# EAGLE design RadioBerry (EAGLE 7.7.0)
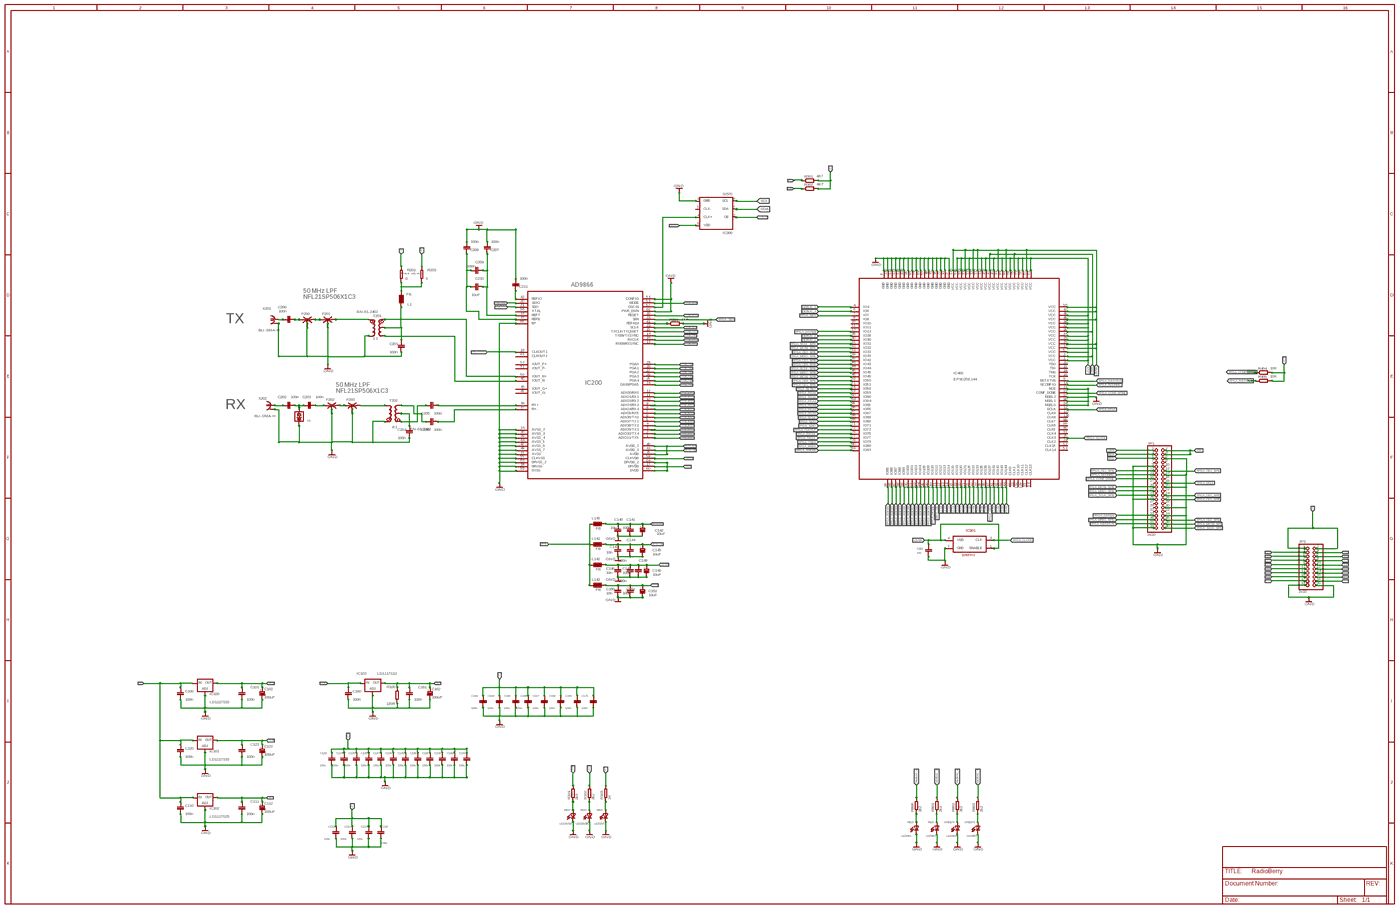
[diagram p0: schematic, sheet 1, overview]
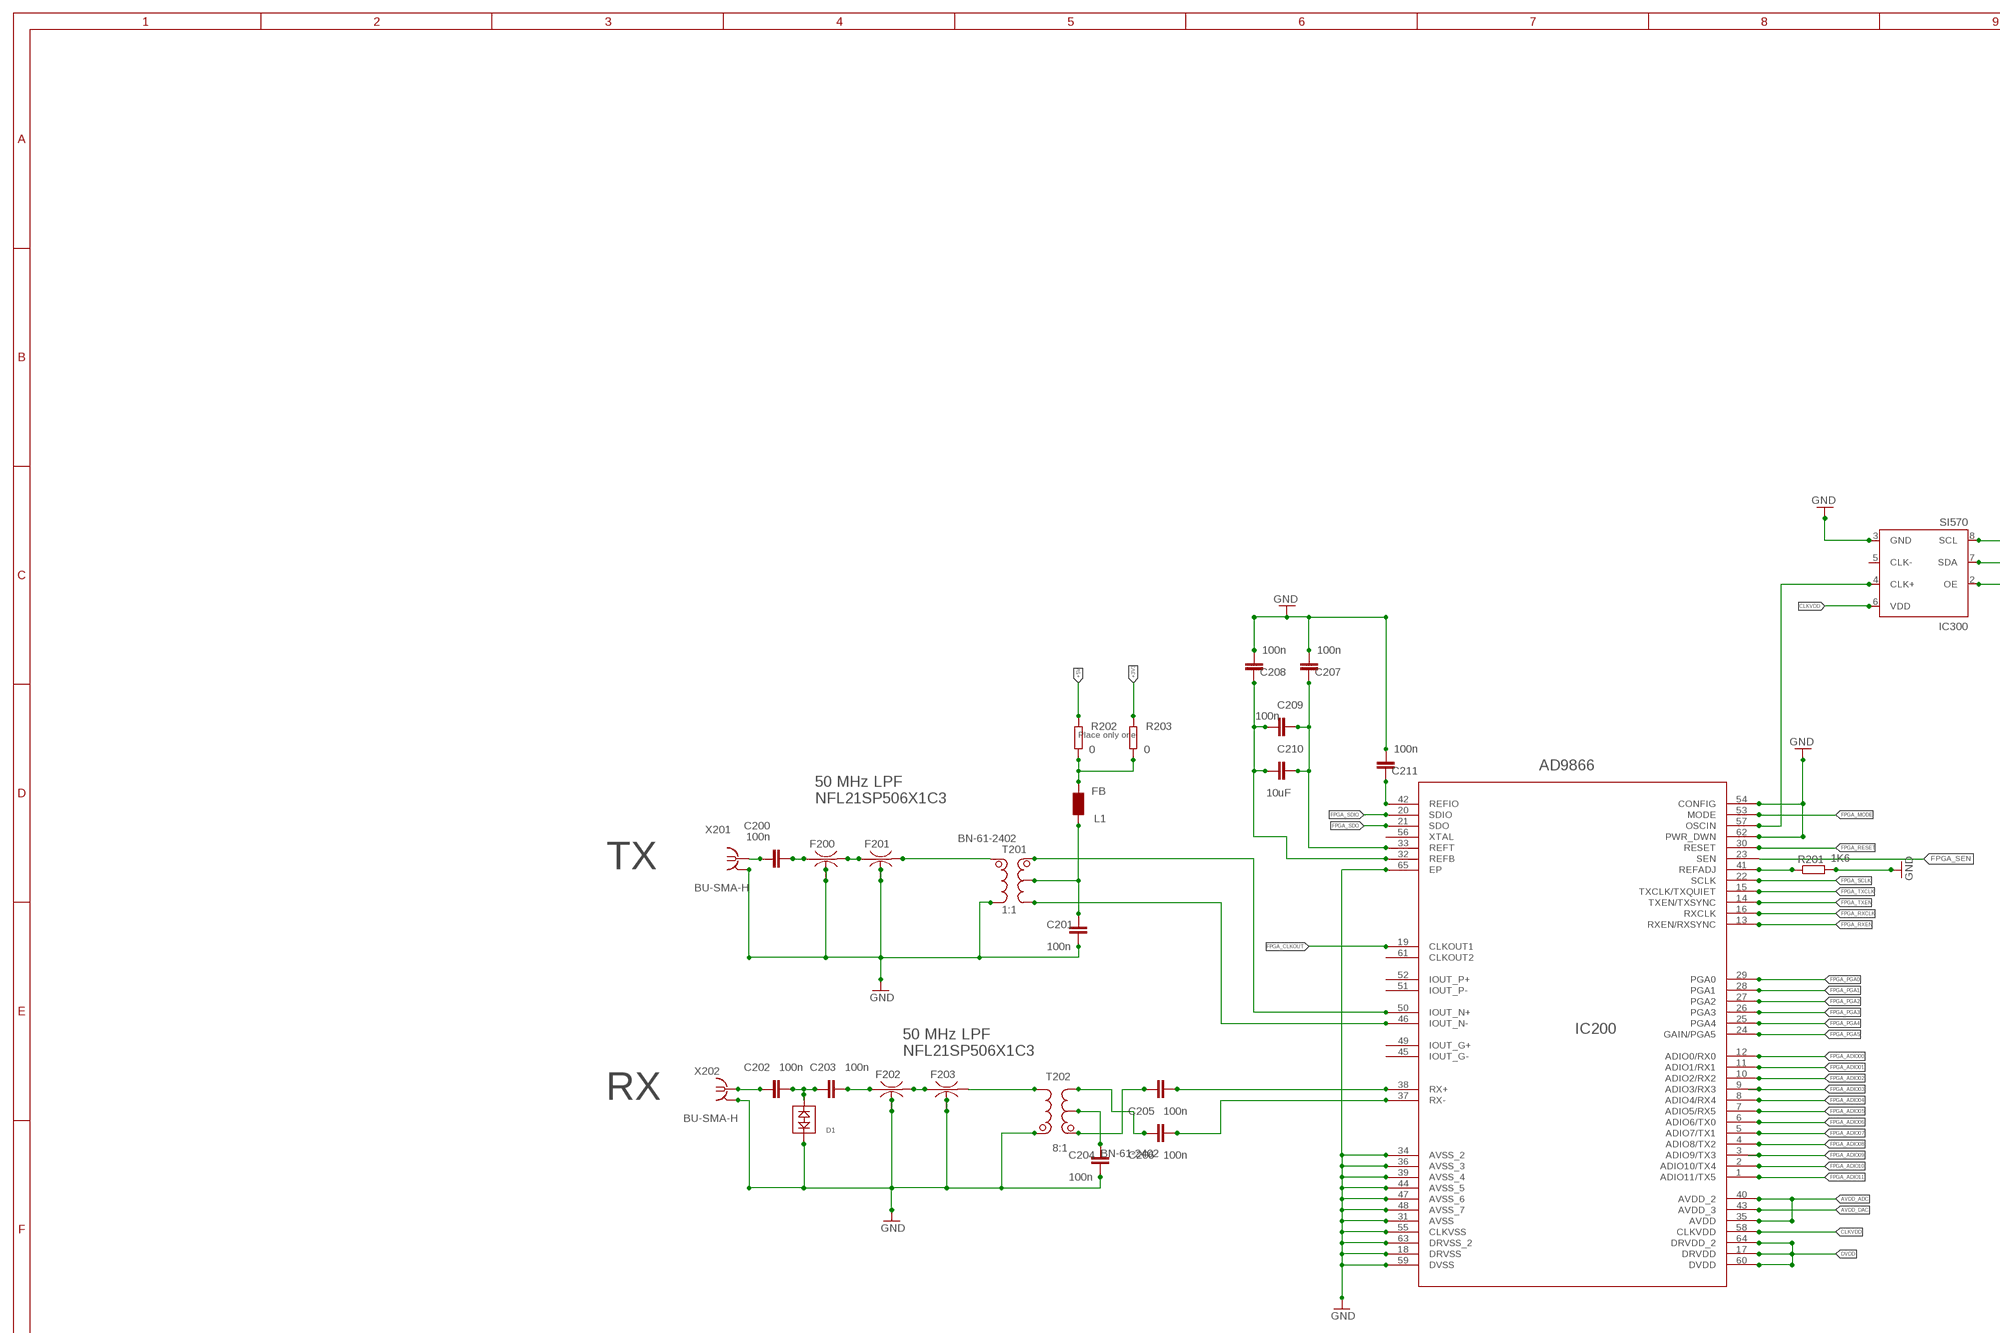
[diagram p1: schematic, sheet 1, part 1 of 4]
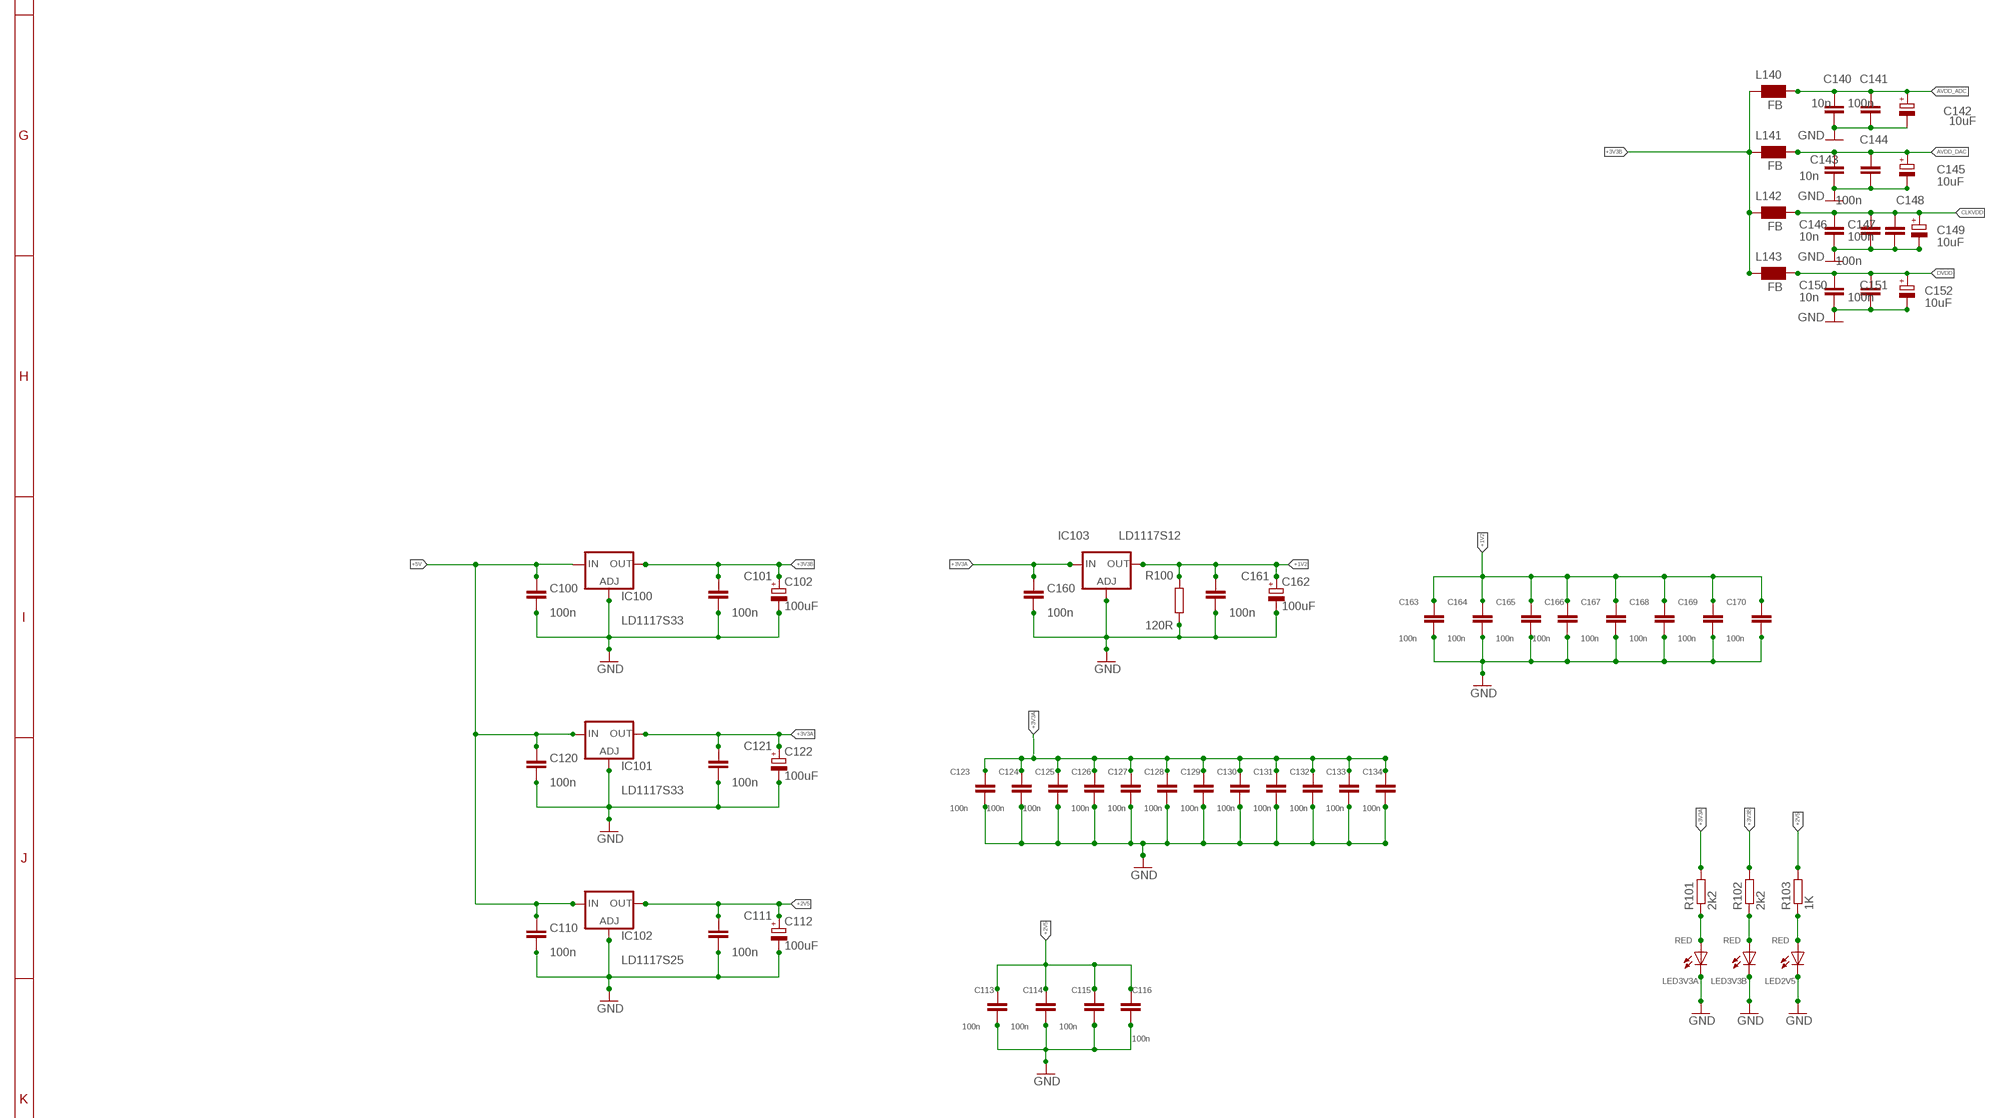
[diagram p2: schematic, sheet 1, part 2 of 4]
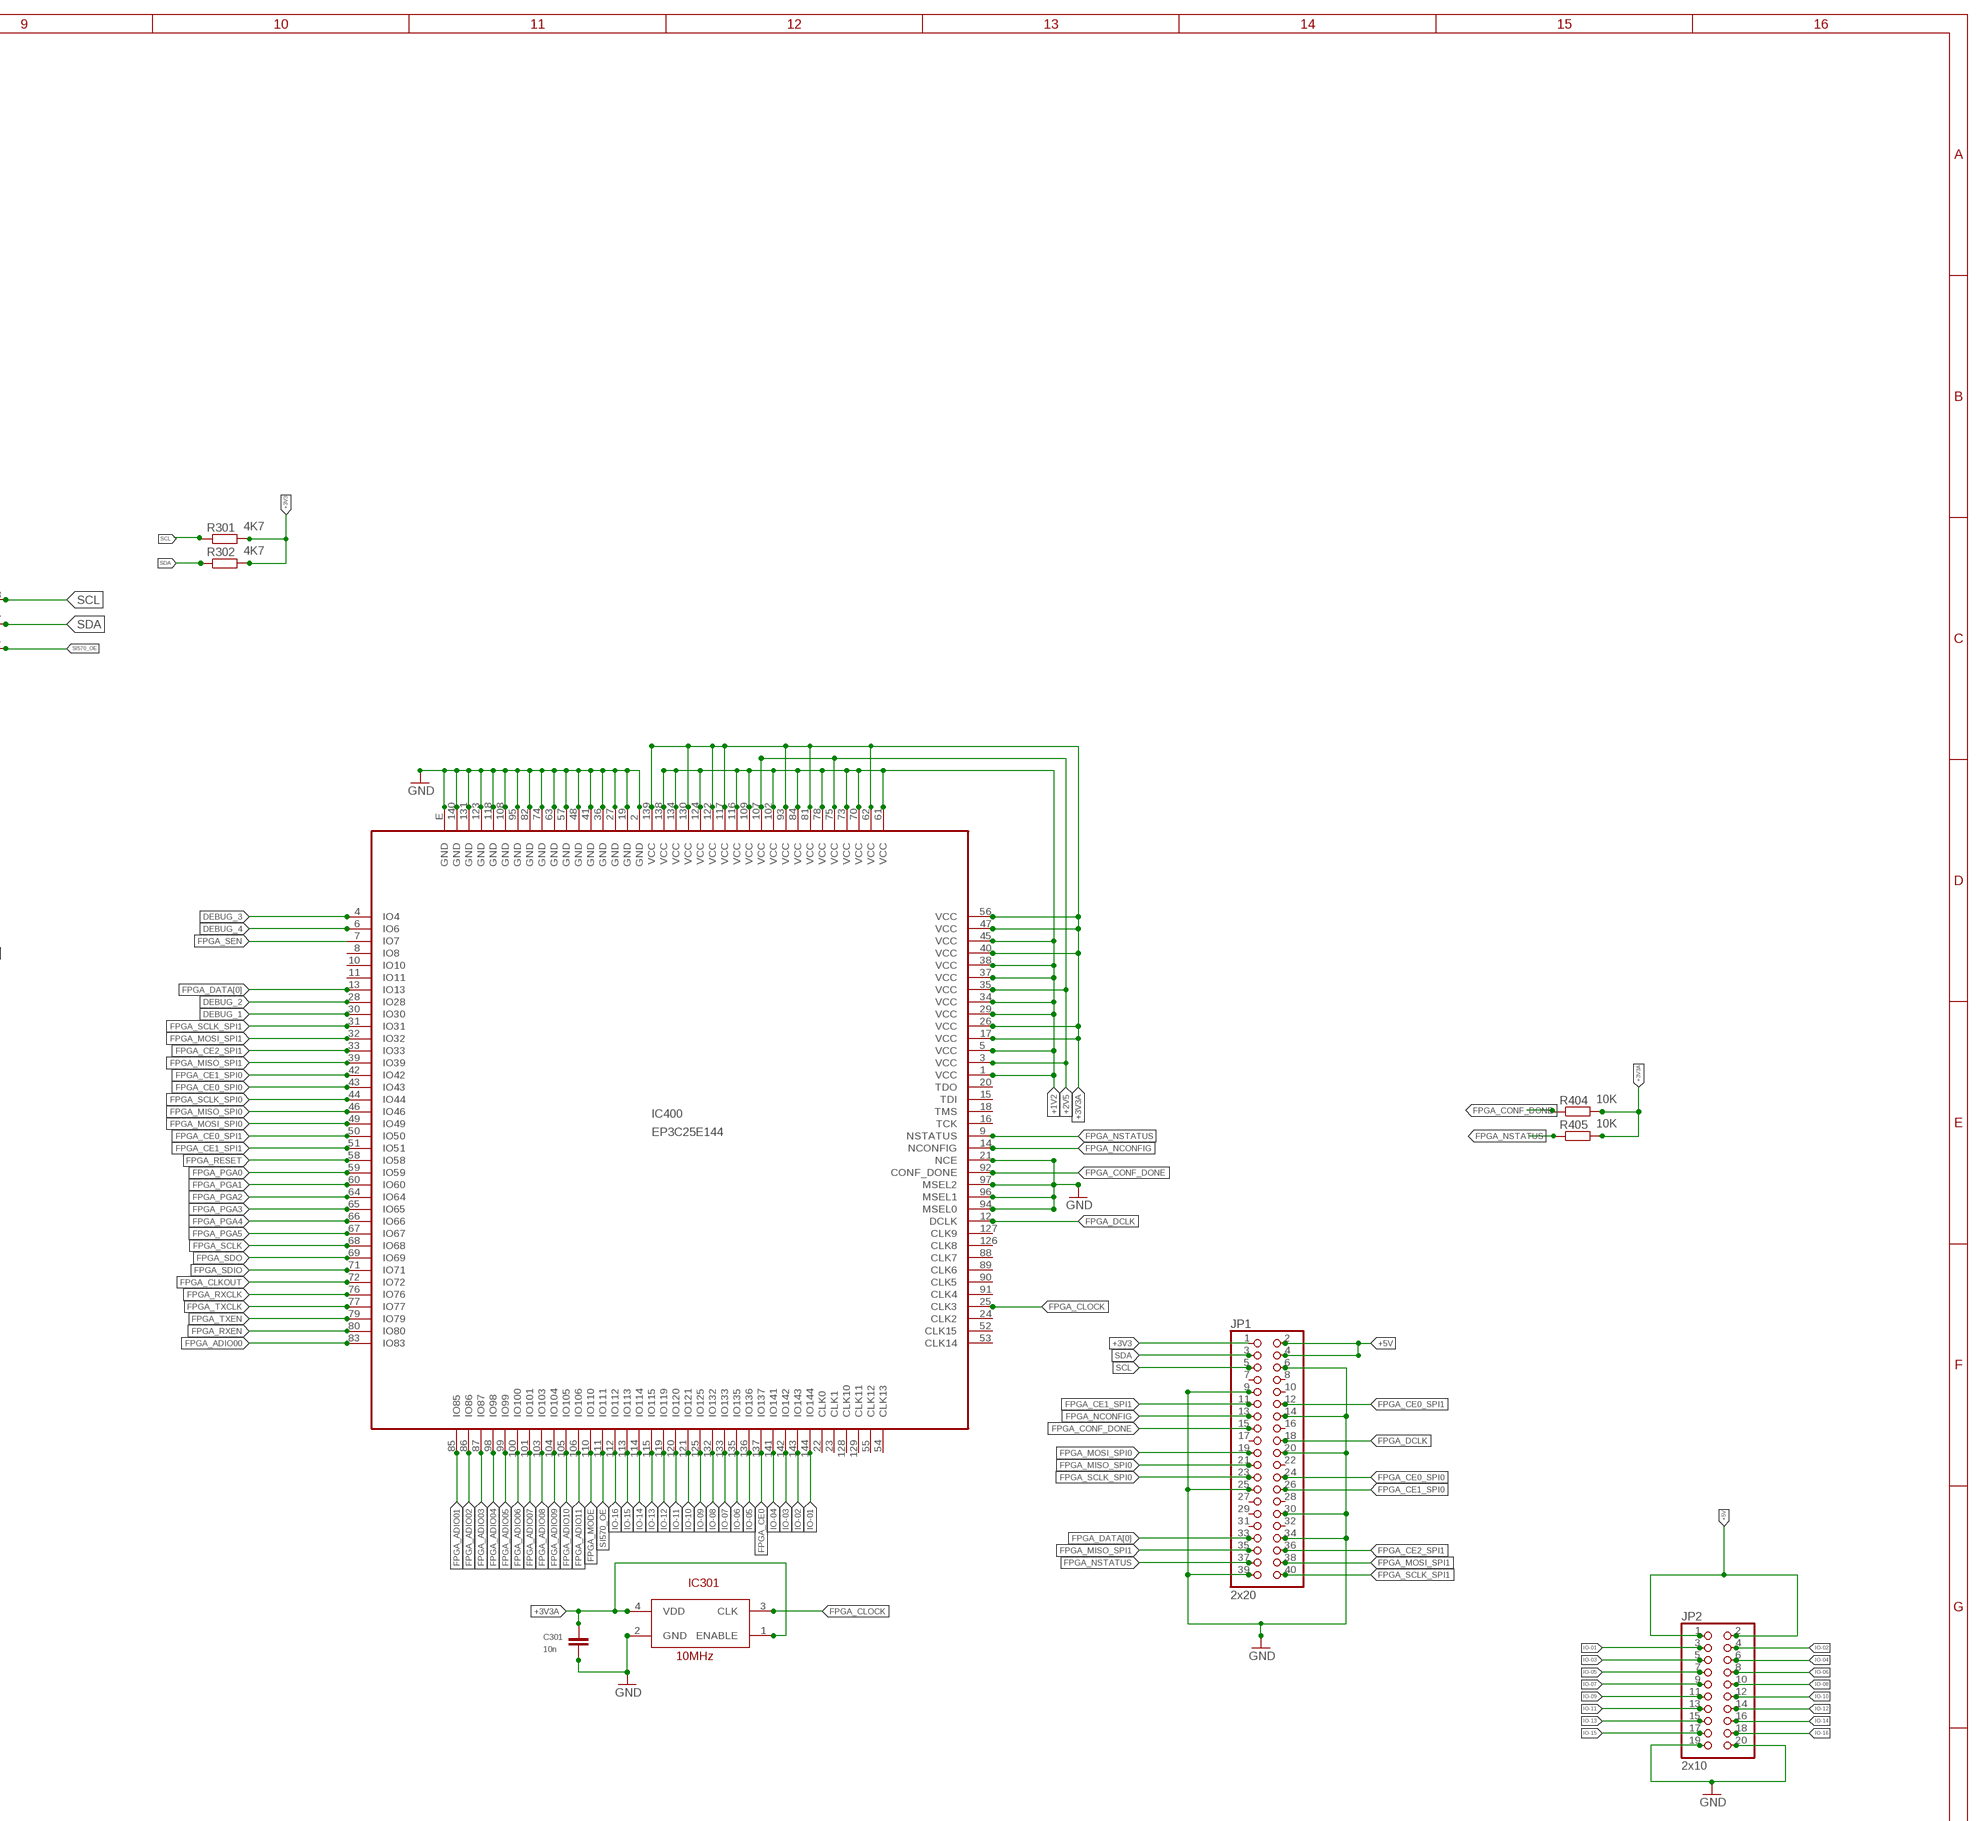
[diagram p3: schematic, sheet 1, part 3 of 4]
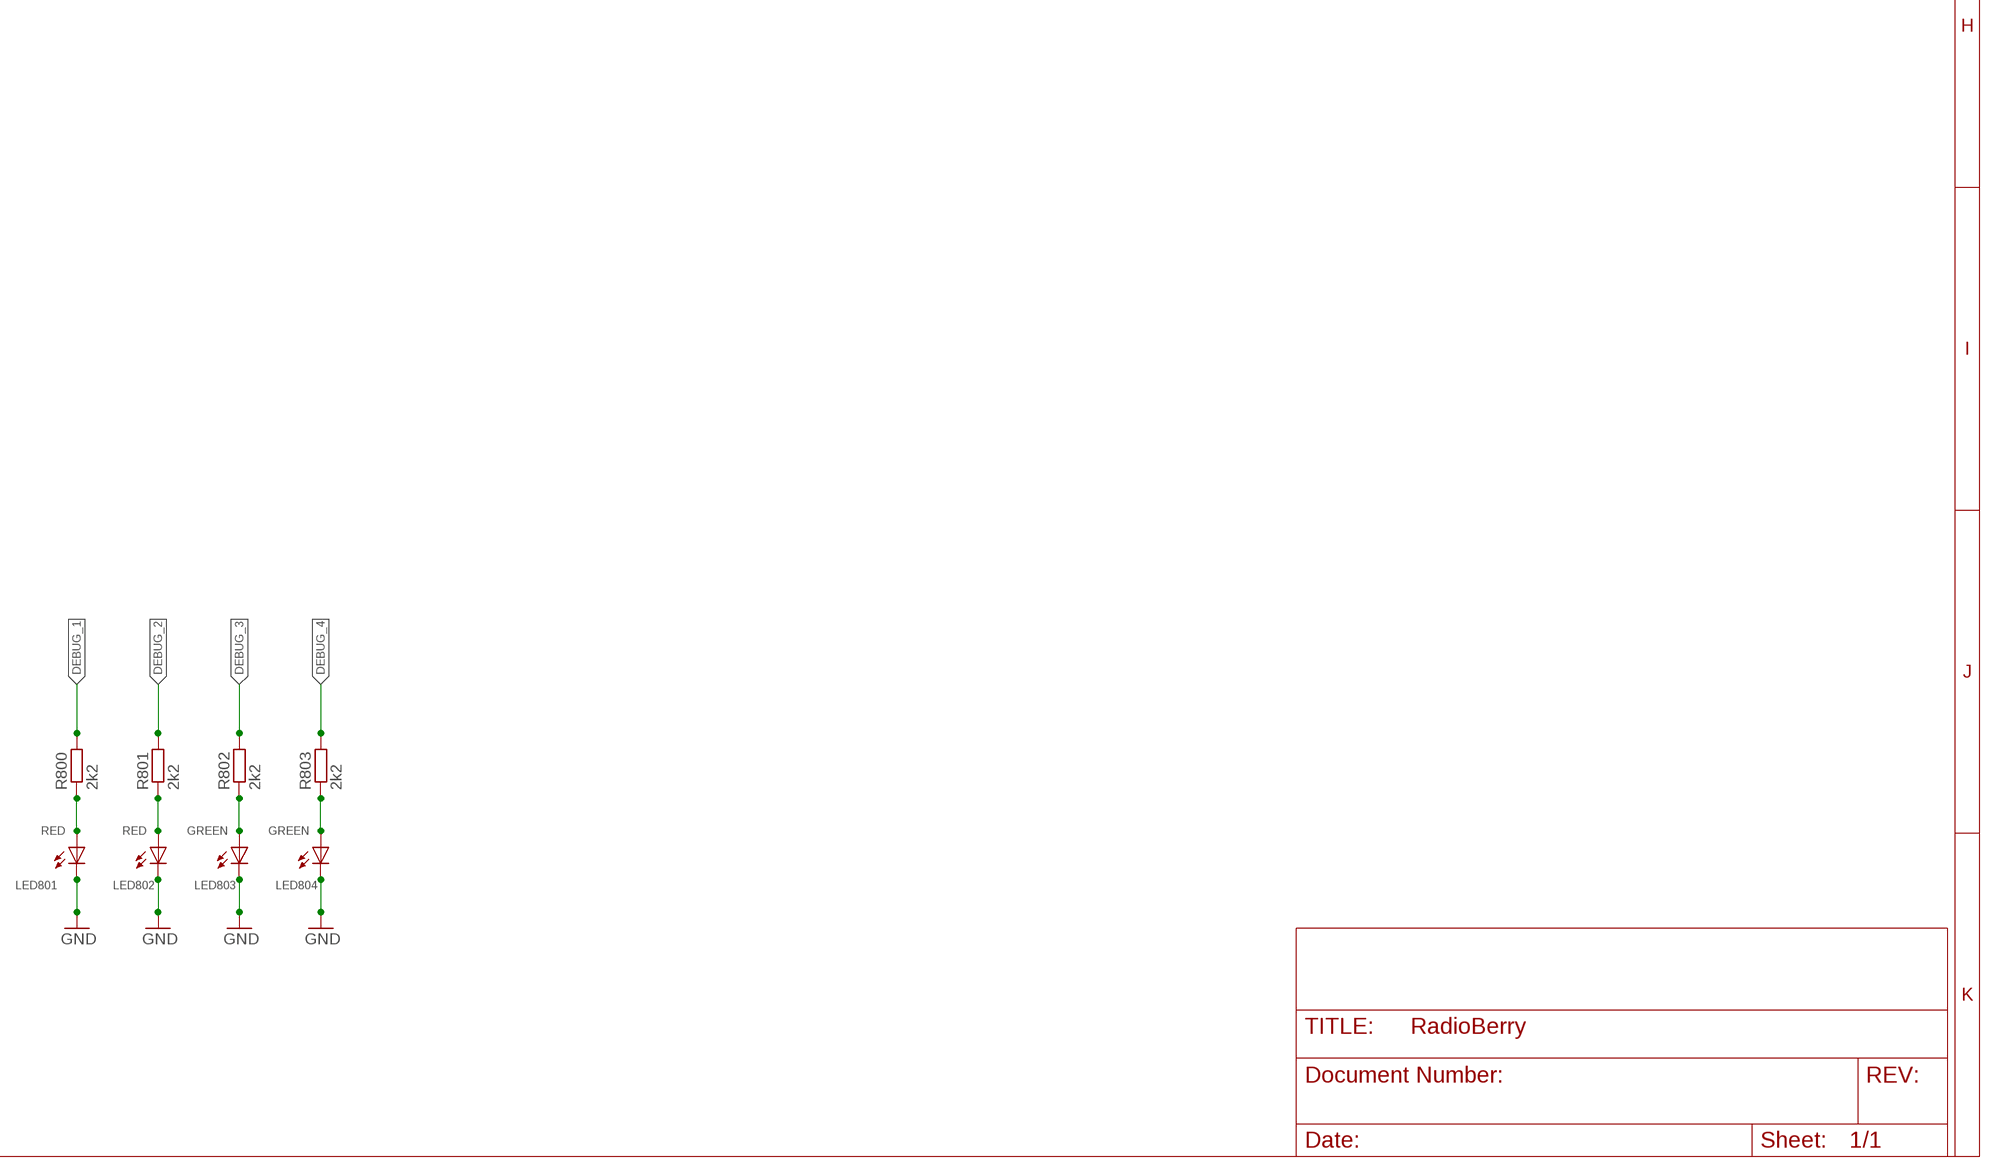
[diagram p4: schematic, sheet 1, part 4 of 4]

## Parts
C100  100n  C-EUC0603  [C0603]
C101  100n  C-EUC0603  [C0603]
C102  100uF  CPOL-EUSMCA  [SMC_A]
C110  100n  C-EUC0603  [C0603]
C111  100n  C-EUC0603  [C0603]
C112  100uF  CPOL-EUSMCA  [SMC_A]
C113  100n  C-EUC0603  [C0603]
C114  100n  C-EUC0603  [C0603]
C115  100n  C-EUC0603  [C0603]
C116  100n  C-EUC0603  [C0603]
C120  100n  C-EUC0603  [C0603]
C121  100n  C-EUC0603  [C0603]
C122  100uF  CPOL-EUSMCA  [SMC_A]
C123  100n  C-EUC0603  [C0603]
C124  100n  C-EUC0603  [C0603]
C125  100n  C-EUC0603  [C0603]
C126  100n  C-EUC0603  [C0603]
C127  100n  C-EUC0603  [C0603]
C128  100n  C-EUC0603  [C0603]
C129  100n  C-EUC0603  [C0603]
C130  100n  C-EUC0603  [C0603]
C131  100n  C-EUC0603  [C0603]
C132  100n  C-EUC0603  [C0603]
C133  100n  C-EUC0603  [C0603]
C134  100n  C-EUC0603  [C0603]
C140  10n  C-EUC0603  [C0603]
C141  100n  C-EUC0603  [C0603]
C142  10uF  CPOL-EUSMCA  [SMC_A]
C143  10n  C-EUC0603  [C0603]
C144  100n  C-EUC0603  [C0603]
C145  10uF  CPOL-EUSMCA  [SMC_A]
C146  10n  C-EUC0603  [C0603]
C147  100n  C-EUC0603  [C0603]
C148  100n  C-EUC0603  [C0603]
C149  10uF  CPOL-EUSMCA  [SMC_A]
C150  10n  C-EUC0603  [C0603]
C151  100n  C-EUC0603  [C0603]
C152  10uF  CPOL-EUSMCA  [SMC_A]
C160  100n  C-EUC0603  [C0603]
C161  100n  C-EUC0603  [C0603]
C162  100uF  CPOL-EUSMCA  [SMC_A]
C163  100n  C-EUC0603  [C0603]
C164  100n  C-EUC0603  [C0603]
C165  100n  C-EUC0603  [C0603]
C166  100n  C-EUC0603  [C0603]
C167  100n  C-EUC0603  [C0603]
C168  100n  C-EUC0603  [C0603]
C169  100n  C-EUC0603  [C0603]
C170  100n  C-EUC0603  [C0603]
C200  100n  C-EUC0603  [C0603]
C201  100n  C-EUC0603  [C0603]
C202  100n  C-EUC0603  [C0603]
C203  100n  C-EUC0603  [C0603]
C204  100n  C-EUC0603  [C0603]
C205  100n  C-EUC0603  [C0603]
C206  100n  C-EUC0603  [C0603]
C207  100n  C-EUC0603  [C0603]
C208  100n  C-EUC0603  [C0603]
C209  100n  C-EUC0603  [C0603]
C210  10uF  C-EUC1206  [C1206]
C211  100n  C-EUC0603  [C0603]
C301  10n  C-EUC0603  [C0603]
D1  GBLC03C  [SOD-323]
F200  NFM21C  [NFM21C]
F201  NFM21C  [NFM21C]
F202  NFM21C  [NFM21C]
F203  NFM21C  [NFM21C]
IC100  LD1117S33  LD117AS33TR  [SOT223]
IC101  LD1117S33  LD117AS33TR  [SOT223]
IC102  LD1117S25  LD117AS33TR  [SOT223]
IC103  LD1117S12  LD117AS12TR  [SOT223]
IC200  AD9866  [CP_64_3]
IC300  SI570  [8-PIN]
IC301  10MHz  CLOCK  [MODEL625]
IC400  EP3C25E144  [EQFP144]
JP1  2x20  PINHD-2X20  [2X20]
JP2  2x10  PINHD-2X10  [2X10]
L1  FB  WE-CBF_0805  [0805]
L140  FB  WE-CBF_0805  [0805]
L141  FB  WE-CBF_0805  [0805]
L142  FB  WE-CBF_0805  [0805]
L143  FB  WE-CBF_0805  [0805]
LED2V5  RED  LEDCHIP-LED0805  [CHIP-LED0805]
LED3V3A  RED  LEDCHIP-LED0805  [CHIP-LED0805]
LED3V3B  RED  LEDCHIP-LED0805  [CHIP-LED0805]
LED801  RED  LEDCHIP-LED0805  [CHIP-LED0805]
LED802  RED  LEDCHIP-LED0805  [CHIP-LED0805]
LED803  GREEN  LEDCHIP-LED0805  [CHIP-LED0805]
LED804  GREEN  LEDCHIP-LED0805  [CHIP-LED0805]
R100  120R  R-EU_R0805  [R0805]
R101  2k2  R-EU_R0805  [R0805]
R102  2k2  R-EU_R0805  [R0805]
R103  1K  R-EU_R0805  [R0805]
R201  1K6  R-EU_R0805  [R0805]
R202  0  R-EU_R0805  [R0805]
R203  0  R-EU_R0805  [R0805]
R301  4K7  R-EU_R0805  [R0805]
R302  4K7  R-EU_R0805  [R0805]
R404  10K  R-EU_R0805  [R0805]
R405  10K  R-EU_R0805  [R0805]
R800  2k2  R-EU_R0805  [R0805]
R801  2k2  R-EU_R0805  [R0805]
R802  2k2  R-EU_R0805  [R0805]
R803  2k2  R-EU_R0805  [R0805]
T201  BN-61-2402  T1-1TDIL  [DIL06]
T202  BN-61-2402  T1-1TDIL  [DIL06]
X201  BU-SMA-H  [BU-SMA-H]
X202  BU-SMA-H  [BU-SMA-H]

## Nets
+1V2: C161.2 C162.+ C163.2 C164.2 C165.2 C166.2 C167.2 C168.2 C169.2 C170.2 IC103.4(OUT) IC400.1(VCC) IC400.5(VCC) IC400.29(VCC) IC400.34(VCC) IC400.37(VCC) IC400.38(VCC) IC400.45(VCC) IC400.61(VCC) IC400.70(VCC) IC400.73(VCC) IC400.78(VCC) IC400.84(VCC) IC400.102(VCC) IC400.109(VCC) IC400.116(VCC) IC400.124(VCC) IC400.134(VCC) IC400.138(VCC) R100.2
+2V5: C111.2 C112.+ C113.2 C114.2 C115.2 C116.2 IC102.4(OUT) IC400.3(VCC) IC400.35(VCC) IC400.75(VCC) IC400.107(VCC) R103.2
+3V3: JP1.1 R203.2 R301.2 R302.2
+3V3A: C121.2 C122.+ C123.2 C124.2 C125.2 C126.2 C127.2 C128.2 C129.2 C130.2 C131.2 C132.2 C133.2 C134.2 C160.2 C301.2 IC101.4(OUT) IC103.3(IN) IC301.1(ENABLE) IC301.4(VDD) IC400.17(VCC) IC400.26(VCC) IC400.40(VCC) IC400.47(VCC) IC400.56(VCC) IC400.62(VCC) IC400.81(VCC) IC400.93(VCC) IC400.117(VCC) IC400.122(VCC) IC400.130(VCC) IC400.139(VCC) R101.2 R404.2 R405.2
+3V3B: C101.2 C102.+ IC100.4(OUT) L140.1 L141.1 L142.1 L143.1 R102.2
+5V: C100.2 C110.2 C120.2 IC100.3(IN) IC101.3(IN) IC102.3(IN) JP1.2 JP1.4 JP2.1 JP2.2 R202.2
AVDD_ADC: C140.2 C141.2 C142.+ IC200.35(AVDD) IC200.40(AVDD_2) L140.2
AVDD_DAC: C143.2 C144.2 C145.+ IC200.43(AVDD_3) L141.2
CLK: IC200.57(OSCIN) IC300.4(CLK+)
CLKVDD: C146.2 C147.2 C148.2 C149.+ IC200.58(CLKVDD) IC300.6(VDD) L142.2
DEBUG_1: IC400.30(IO30) R800.2
DEBUG_2: IC400.28(IO28) R801.2
DEBUG_3: IC400.4(IO4) R802.2
DEBUG_4: IC400.6(IO6) R803.2
DVDD: C150.2 C151.2 C152.+ IC200.17(DRVDD) IC200.60(DVDD) IC200.64(DRVDD_2) L143.2
FPGA_ADIO00: IC200.12(ADIO0/RX0) IC400.83(IO83)
FPGA_ADIO01: IC200.11(ADIO1/RX1) IC400.85(IO85)
FPGA_ADIO02: IC200.10(ADIO2/RX2) IC400.86(IO86)
FPGA_ADIO03: IC200.9(ADIO3/RX3) IC400.87(IO87)
FPGA_ADIO04: IC200.8(ADIO4/RX4) IC400.98(IO98)
FPGA_ADIO05: IC200.7(ADIO5/RX5) IC400.99(IO99)
FPGA_ADIO06: IC200.6(ADIO6/TX0) IC400.100(IO100)
FPGA_ADIO07: IC200.5(ADIO7/TX1) IC400.101(IO101)
FPGA_ADIO08: IC200.4(ADIO8/TX2) IC400.103(IO103)
FPGA_ADIO09: IC200.3(ADIO9/TX3) IC400.104(IO104)
FPGA_ADIO10: IC200.2(ADIO10/TX4) IC400.105(IO105)
FPGA_ADIO11: IC200.1(ADIO11/TX5) IC400.106(IO106)
FPGA_CE0: IC400.137(IO137)
FPGA_CE0_SPI0: IC400.43(IO43) JP1.24
FPGA_CE0_SPI1: IC400.50(IO50) JP1.12
FPGA_CE1_SPI0: IC400.42(IO42) JP1.26
FPGA_CE1_SPI1: IC400.51(IO51) JP1.11
FPGA_CE2_SPI1: IC400.33(IO33) JP1.36
FPGA_CLKOUT: IC200.19(CLKOUT1) IC400.72(IO72)
FPGA_CLOCK: IC301.3(CLK) IC400.25(CLK3)
FPGA_CONF_DONE: IC400.92(CONF_DONE) JP1.15 R404.1
FPGA_DATA[0]: IC400.13(IO13) JP1.33
FPGA_DCLK: IC400.12(DCLK) JP1.18
FPGA_MISO_SPI0: IC400.46(IO46) JP1.21
FPGA_MISO_SPI1: IC400.39(IO39) JP1.35
FPGA_MODE: IC200.53(MODE) IC400.110(IO110)
FPGA_MOSI_SPI0: IC400.49(IO49) JP1.19
FPGA_MOSI_SPI1: IC400.32(IO32) JP1.38
FPGA_NCONFIG: IC400.14(NCONFIG) JP1.13
FPGA_NSTATUS: IC400.9(NSTATUS) JP1.37 R405.1
FPGA_PGA0: IC200.29(PGA0) IC400.59(IO59)
FPGA_PGA1: IC200.28(PGA1) IC400.60(IO60)
FPGA_PGA2: IC200.27(PGA2) IC400.64(IO64)
FPGA_PGA3: IC200.26(PGA3) IC400.65(IO65)
FPGA_PGA4: IC200.25(PGA4) IC400.66(IO66)
FPGA_PGA5: IC200.24(GAIN/PGA5) IC400.67(IO67)
FPGA_RESET: IC200.30(RESET) IC400.58(IO58)
FPGA_RXCLK: IC200.16(RXCLK) IC400.76(IO76)
FPGA_RXEN: IC200.13(RXEN/RXSYNC) IC400.80(IO80)
FPGA_SCLK: IC200.22(SCLK) IC400.68(IO68)
FPGA_SCLK_SPI0: IC400.44(IO44) JP1.23
FPGA_SCLK_SPI1: IC400.31(IO31) JP1.40
FPGA_SDIO: IC200.20(SDIO) IC400.71(IO71)
FPGA_SDO: IC200.21(SDO) IC400.69(IO69)
FPGA_SEN: IC200.23(SEN) IC400.7(IO7)
FPGA_TXCLK: IC200.15(TXCLK/TXQUIET) IC400.77(IO77)
FPGA_TXEN: IC200.14(TXEN/TXSYNC) IC400.79(IO79)
GND: C100.1 C101.1 C102.- C110.1 C111.1 C112.- C113.1 C114.1 C115.1 C116.1 C120.1 C121.1 C122.- C123.1 C124.1 C125.1 C126.1 C127.1 C128.1 C129.1 C130.1 C131.1 C132.1 C133.1 C134.1 C140.1 C141.1 C142.- C143.1 C144.1 C145.- C146.1 C147.1 C148.1 C149.- C150.1 C151.1 C152.- C160.1 C161.1 C162.- C163.1 C164.1 C165.1 C166.1 C167.1 C168.1 C169.1 C170.1 C201.1 C204.1 C207.1 C208.1 C211.1 C301.1 D1.B F200.2@1 F200.2@2 F201.2@1 F201.2@2 F202.2@1 F202.2@2 F203.2@1 F203.2@2 IC100.1(ADJ) IC101.1(ADJ) IC102.1(ADJ) IC103.1(ADJ) IC200.18(DRVSS) IC200.31(AVSS) IC200.34(AVSS_2) IC200.36(AVSS_3) IC200.39(AVSS_4) IC200.44(AVSS_5) IC200.47(AVSS_6) IC200.48(AVSS_7) IC200.54(CONFIG) IC200.55(CLKVSS) IC200.59(DVSS) IC200.62(PWR_DWN) IC200.63(DRVSS_2) IC200.65(EP) IC300.3(GND) IC301.2(GND) IC400.2(GND) IC400.19(GND) IC400.21(NCE) IC400.27(GND) IC400.36(GND) IC400.41(GND) IC400.48(GND) IC400.57(GND) IC400.63(GND) IC400.74(GND) IC400.82(GND) IC400.94(MSEL0) IC400.95(GND) IC400.96(MSEL1) IC400.97(MSEL2) IC400.108(GND) IC400.118(GND) IC400.123(GND) IC400.131(GND) IC400.140(GND) IC400.E(GND) JP1.6 JP1.9 JP1.14 JP1.20 JP1.25 JP1.30 JP1.34 JP1.39 JP2.19 JP2.20 LED2V5.C LED3V3A.C LED3V3B.C LED801.C LED802.C LED803.C LED804.C R100.1 R201.2 T201.1(P2) T202.3(P1) X201.2 X201.3 X201.4 X201.5 X202.2 X202.3 X202.4 X202.5
IO-01: IC400.144(IO144) JP2.3
IO-02: IC400.143(IO143) JP2.4
IO-03: IC400.142(IO142) JP2.5
IO-04: IC400.141(IO141) JP2.6
IO-05: IC400.136(IO136) JP2.7
IO-06: IC400.135(IO135) JP2.8
IO-07: IC400.133(IO133) JP2.9
IO-08: IC400.132(IO132) JP2.10
IO-09: IC400.125(IO125) JP2.11
IO-10: IC400.121(IO121) JP2.12
IO-11: IC400.120(IO120) JP2.13
IO-12: IC400.119(IO119) JP2.14
IO-13: IC400.115(IO115) JP2.15
IO-14: IC400.114(IO114) JP2.16
IO-15: IC400.113(IO113) JP2.17
IO-16: IC400.112(IO112) JP2.18
N$1: L1.2 R202.1 R203.1
N$2: F203.3 T202.1(P2)
N$3: C205.2 T202.4(S1)
N$4: C201.2 L1.1 T201.5(ST)
N$5: C202.1 C203.2 D1.A
N$6: IC200.50(IOUT_N+) T201.4(S1)
N$7: IC200.46(IOUT_N-) T201.6(S2)
N$8: C206.2 T202.6(S2)
N$10: LED3V3B.A R102.1
N$11: LED2V5.A R103.1
N$13: C206.1 IC200.37(RX-)
N$14: C204.2 T202.5(ST)
N$15: C205.1 IC200.38(RX+)
N$16: LED801.A R800.1
N$17: LED802.A R801.1
N$18: LED803.A R802.1
N$19: LED804.A R803.1
N$20: LED3V3A.A R101.1
N$25: F202.3 F203.1
N$28: C202.2 X202.1
N$29: C203.1 F202.1
N$30: C207.2 C209.2 C210.2 IC200.33(REFT)
N$32: C208.2 C209.1 C210.1 IC200.32(REFB)
N$33: C211.2 IC200.42(REFIO)
N$34: IC200.41(REFADJ) R201.1
N$69: C200.2 X201.1
N$71: C200.1 F200.1
N$72: F200.3 F201.1
N$73: F201.3 T201.3(P1)
SCL: IC300.8(SCL) JP1.5 R301.1
SDA: IC300.7(SDA) JP1.3 R302.1
SI570_OE: IC300.2(OE) IC400.111(IO111)
Unconnected: IC200.45(IOUT_G-) IC200.49(IOUT_G+) IC200.51(IOUT_P-) IC200.52(IOUT_P+) IC200.56(XTAL) IC200.61(CLKOUT2) IC300.5(CLK-) IC400.8(IO8) IC400.10(IO10) IC400.11(IO11) IC400.15(TDI) IC400.16(TCK) IC400.18(TMS) IC400.20(TDO) IC400.22(CLK0) IC400.23(CLK1) IC400.24(CLK2) IC400.52(CLK15) IC400.53(CLK14) IC400.54(CLK13) IC400.55(CLK12) IC400.88(CLK7) IC400.89(CLK6) IC400.90(CLK5) IC400.91(CLK4) IC400.126(CLK8) IC400.127(CLK9) IC400.128(CLK10) IC400.129(CLK11) JP1.7 JP1.8 JP1.10 JP1.16 JP1.17 JP1.22 JP1.27 JP1.28 JP1.29 JP1.31 JP1.32

## Notes on the sheet
- Configuration
- Place only one
- 50 MHz LPF
  NFL21SP506X1C3
- TX
- 1:1
- 50 MHz LPF
  NFL21SP506X1C3
- RX
- 8:1
- Power Supply
- [100]

## Library data of the parts
C100 C101 C110 C111 C113-C116 C120 C121 C123-C134 C140 C141 C143 C144 C146-C148 C150 C151 C160 C161 C163-C170 C200-C211 C301 = rcl:C-EU: CAPACITOR, European symbol
C102 C112 C122 C142 C145 C149 C152 C162 = rcl:CPOL-EU: POLARIZED CAPACITOR, European symbol
D1 = pa3gsb:GBLC03C
F200-F203 = murata-filter:NFM: EMIFIL(R) (Capacitor type) Single Circuit Type for Signal Lines Source: http://search.murata.co.jp/Ceramy/image/img/PDF/ENG/L0111S0109NFM3DC.pdf
IC100-IC103 = v-reg:LD117A?*: Low drop fixed and adjustable positive voltage regulators 1 A Source: http://www.st.com/stonline/products/literature/ds/7194/ld1117axx.pdf
IC200 = AD9866:AD9866
IC300 = silabs:SI570: ANY-RATE I2C PROGRAMMABLE XO/VCXO Source: si570.pdf; OC_FARNELL: unknown; OC_NEWARK: unknown
IC301 = AVS-Clock:CLOCK
IC400 = altera-cyclone-III:EP3C25E144: EP3C25E144 edit this description Auto generated by make-symbol-device-package-bsdl.ulp Rev. 20 Source: EP3C25E144.bsd http://www.altera.com/support/devices/bsdl/cyclone3/cyc3-index.jsp; MPN: EP3C25E144C8N; OC_FARNELL: 1453474; OC_NEWARK: 51R0605
JP1 = pinhead:PINHD-2X20: PIN HEADER
JP2 = pinhead:PINHD-2X10: PIN HEADER
L1 L140-L143 = wuerth-elektronik:WE-CBF: SMD EMI Suppression Ferrite Beads - excellent anti-EMI properties - low DCR - impedances till 3000 ohms - rated current up to 6 A
LED2V5 LED3V3A LED3V3B LED801-LED804 = led:LED: LED OSRAM: - CHIPLED LG R971, LG N971, LY N971, LG Q971, LY Q971, LO R971, LY R971 LH N974, LH R974 LS Q976, LO Q976, LY Q976 LO Q996 - Hyper CHIPLED LW Q18S LB Q993, LB Q99A, LB R99A - SideLED LS A670, LO A670, LY A670, LG A670, LP A670 LB A673, LV A673, LT A673, LW A673 LH A674 LY A675 LS A676, LA A676, LO A676, LY A676, LW A676 LS A679, LY A679, LG A679 - Hyper Micro SIDELED® LS Y876, LA Y876, LO Y876, LY Y876 LT Y87S - SmartLED LW L88C, LW L88S LB L89C, LB L89S, LG L890 LS L89K, LO L89K, LY L89K LS L896, LA L896, LO L896, LY L896 - TOPLED LS T670, LO T670, LY T670, LG T670, LP T670 LSG T670, LSP T670, LSY T670, LOP T670, LYG T670 LG T671, LOG T671, LSG T671 LB T673, LV T673, LT T673, LW T673 LH T674 LS T676, LA T676, LO T676, LY T676, LB T676, LH T676, LSB T676, LW T676 LB T67C, LV T67C, LT T67C, LS T67K, LO T67K, LY T67K, LW E67C LS E67B, LA E67B, LO E67B, LY E67B, LB E67C, LV E67C, LT E67C LW T67C LS T679, LY T679, LG T679 LS T770, LO T770, LY T770, LG T770, LP T770 LB T773, LV T773, LT T773, LW T773 LH T774 LS E675, LA E675, LY E675, LS T675 LS T776, LA T776, LO T776, LY T776, LB T776 LHGB T686 LT T68C, LB T68C - Hyper Mini TOPLED® LB M676 - Mini TOPLED Santana® LG M470 LS M47K, LO M47K, LY M47K Source: http://www.osram.convergy.de LUXEON: - LUMILED® LXK2-PW12-R00, LXK2-PW12-S00, LXK2-PW14-U00, LXK2-PW14-V00 LXK2-PM12-R00, LXK2-PM12-S00, LXK2-PM14-U00 LXK2-PE12-Q00, LXK2-PE12-R00, LXK2-PE12-S00, LXK2-PE14-T00, LXK2-PE14-U00 LXK2-PB12-K00, LXK2-PB12-L00, LXK2-PB12-M00, LXK2-PB14-N00, LXK2-PB14-P00, LXK2-PB14-Q00 LXK2-PR12-L00, LXK2-PR12-M00, LXK2-PR14-Q00, LXK2-PR14-R00 LXK2-PD12-Q00, LXK2-PD12-R00, LXK2-PD12-S00 LXK2-PH12-R00, LXK2-PH12-S00 LXK2-PL12-P00, LXK2-PL12-Q00, LXK2-PL12-R00 Source: www.luxeon.com KINGBRIGHT: KA-3528ASYC Source: www.kingbright.com
R100-R103 R201-R203 R301 R302 R404 R405 R800-R803 = rcl:R-EU_: RESISTOR, European symbol
T201 T202 = pa3gsb:T1-1T
X201 X202 = con-coax:BU-SMA-H: FEMALE SMA CONNECTOR Radiall; OC_FARNELL: unknown; OC_NEWARK: unknown

## Board
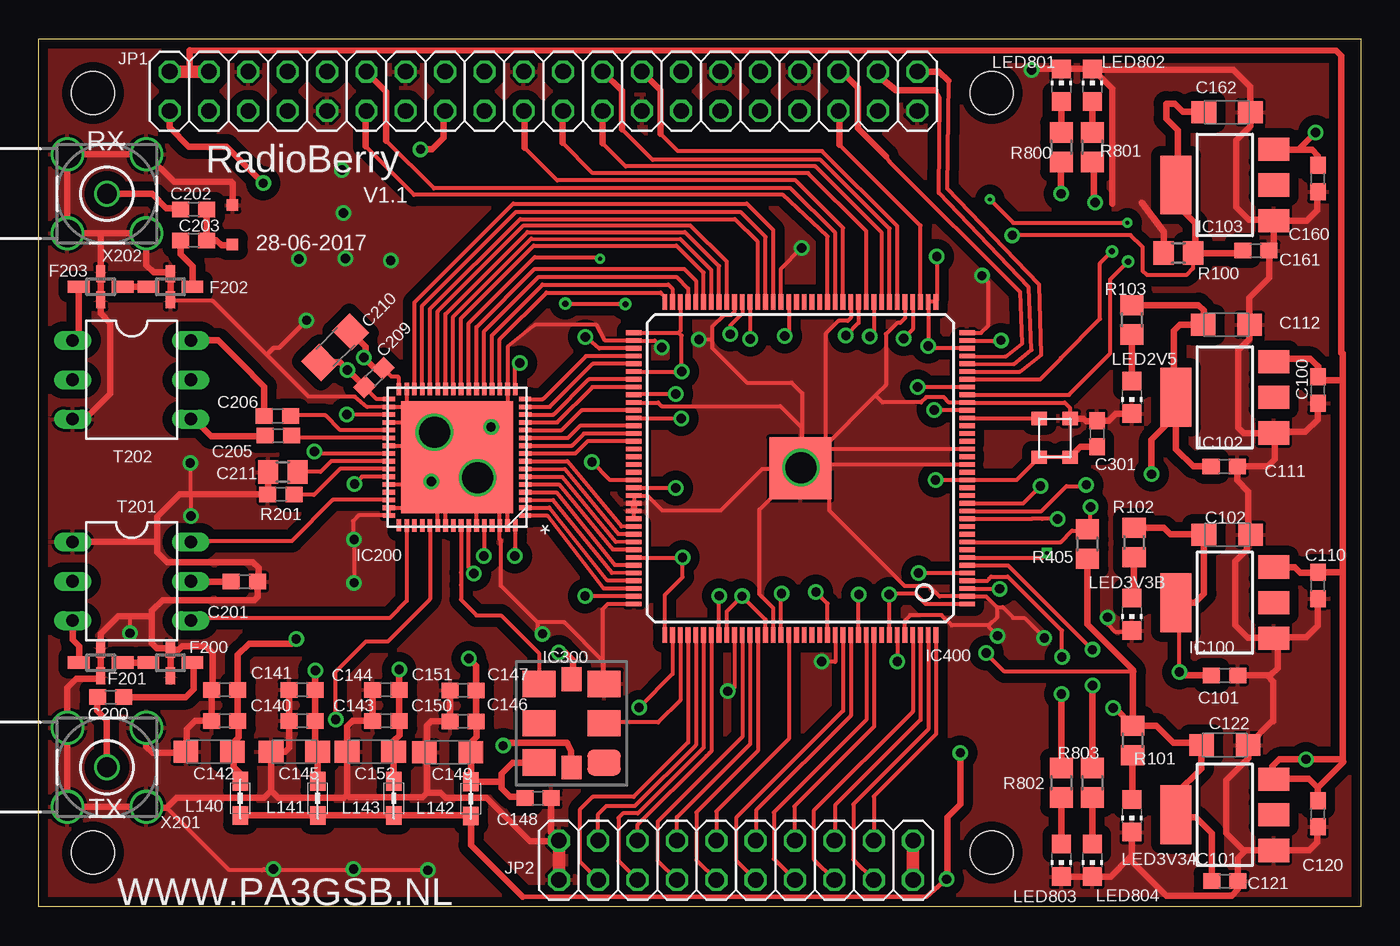
[diagram p5: board, top side]
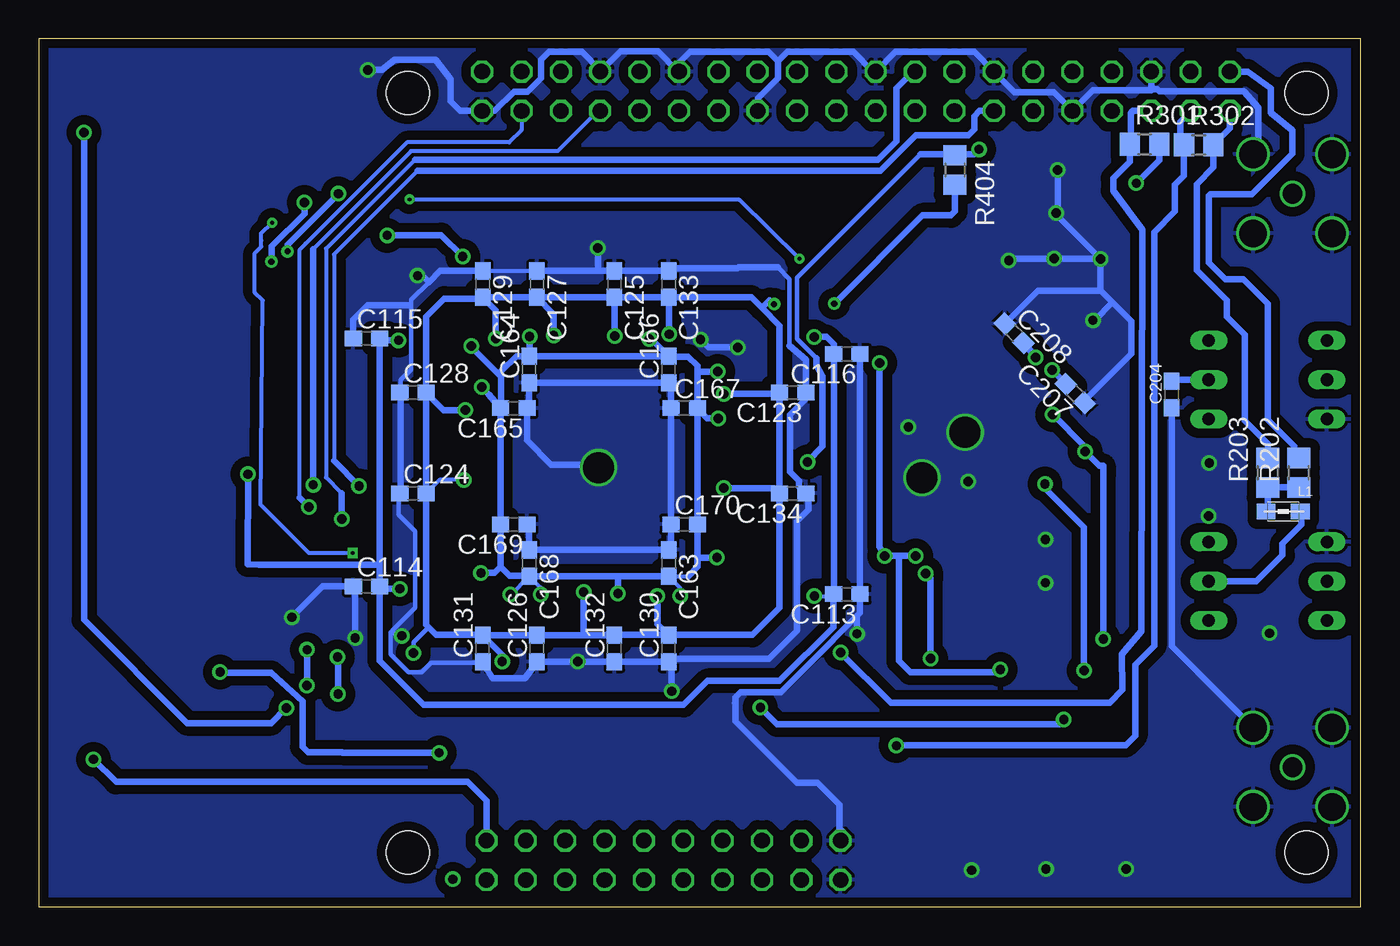
[diagram p6: board, bottom side, seen from below]

Size 85.32 x 56 mm. Coordinates in mm from the lower left corner, seen from the top.
Outline: 0,56 85.32,56 85.32,0 0,0 0,56
Copper layers (1*16): Top 0.018mm / dielectric 1.55mm / Bottom 0.018mm
Design rules "eC-PCB_proto-2-layer": minimum track width 0.15mm, minimum drill 0.25mm, track to track 0.15mm, track to pad 0.15mm, pad to pad 0.15mm, via to via 0.15mm, smd to smd 0.15mm, copper to edge 0.45mm, drill to drill 0.3mm, minimum pad ring 0.2mm, minimum via ring 0.2mm, stop-mask expansion 0.1mm, vias tented up to drill 0mil, thermal gap 0.2mm
Holes 2.75 mm at 3.5,52.5 61.5,52.5 3.5,3.5 61.5,3.5

### Footprints (pad centres in the part's own frame; a part is rotated, then mirrored left to right if it is on the bottom)
C0603 = smd 1.1 x 1: 1 -0.85,0; 2 0.85,0
SMC_A = smd 1.6 x 1.4: + -1.5,0; - 1.5,0
C1206 = smd 1.6 x 1.8: 1 -1.4,0; 2 1.4,0
SOD-323 = smd 0.762 x 0.762: A -1.27,0; B 1.27,0
NFM21C = smd 1.4 x 0.8: 1 -1.425,0; 3 1.425,0 | smd 0.6 x 1.1: 2@1 0,-0.85; 2@2 0,0.85
SOT223 = smd 1.5 x 2: 1 -2.3,-3.15; 2 0,-3.15; 3 2.3,-3.15 | smd 3.8 x 2: 4 0,3.15
CP_64_3 = smd 0.762 x 0.305: 1 -4.394,3.75; 16 -4.394,-3.75; 33 4.394,-3.75; 48 4.394,3.75 | smd 0.813 x 0.305: 2 -4.394,3.25; 3 -4.394,2.75; 4 -4.394,2.25; 5 -4.394,1.75; 6 -4.394,1.25; 7 -4.394,0.75; 8 -4.394,0.25; 9 -4.394,-0.25; 10 -4.394,-0.75; 11 -4.394,-1.25; 12 -4.394,-1.75; 13 -4.394,-2.25; 14 -4.394,-2.75; 15 -4.394,-3.25; 34 4.394,-3.25; 35 4.394,-2.75; 36 4.394,-2.25; 37 4.394,-1.75; 38 4.394,-1.25; 39 4.394,-0.75; 40 4.394,-0.25; 41 4.394,0.25; 42 4.394,0.75; 43 4.394,1.25; 44 4.394,1.75; 45 4.394,2.25; 46 4.394,2.75; 47 4.394,3.25 | smd 0.305 x 0.762: 17 -3.75,-4.394; 32 3.75,-4.394; 49 3.75,4.394; 64 -3.75,4.394 | smd 0.305 x 0.813: 18 -3.25,-4.394; 19 -2.75,-4.394; 20 -2.25,-4.394; 21 -1.75,-4.394; 22 -1.25,-4.394; 23 -0.75,-4.394; 24 -0.25,-4.394; 25 0.25,-4.394; 26 0.75,-4.394; 27 1.25,-4.394; 28 1.75,-4.394; 29 2.25,-4.394; 30 2.75,-4.394; 31 3.25,-4.394; 50 3.25,4.394; 51 2.75,4.394; 52 2.25,4.394; 53 1.75,4.394; 54 1.25,4.394; 55 0.75,4.394; 56 0.25,4.394; 57 -0.25,4.394; 58 -0.75,4.394; 59 -1.25,4.394; 60 -1.75,4.394; 61 -2.25,4.394; 62 -2.75,4.394; 63 -3.25,4.394 | smd 7.239 x 7.239: 65 0,0
8-PIN = smd 1.7 x 2.15: 1 -2.54,-2.1; 2 0,-2.1; 3 2.54,-2.1; 4 2.54,2.1; 5 0,2.1; 6 -2.54,2.1 | smd 1.545 x 1.3: 7 -2.853,0; 8 2.853,0
MODEL625 = smd 1 x 0.85: 1 -1,1.25; 2 -1,-1.25; 3 1,-1.25; 4 1,1.25
EQFP144 = smd 1 x 0.3: 1 -10.75,8.75; 2 -10.75,8.25; 3 -10.75,7.75; 4 -10.75,7.25; 5 -10.75,6.75; 6 -10.75,6.25; 7 -10.75,5.75; 8 -10.75,5.25; 9 -10.75,4.75; 10 -10.75,4.25; 11 -10.75,3.75; 12 -10.75,3.25; 13 -10.75,2.75; 14 -10.75,2.25; 15 -10.75,1.75; 16 -10.75,1.25; 17 -10.75,0.75; 18 -10.75,0.25; 19 -10.75,-0.25; 20 -10.75,-0.75; 21 -10.75,-1.25; 22 -10.75,-1.75; 23 -10.75,-2.25; 24 -10.75,-2.75; 25 -10.75,-3.25; 26 -10.75,-3.75; 27 -10.75,-4.25; 28 -10.75,-4.75; 29 -10.75,-5.25; 30 -10.75,-5.75; 31 -10.75,-6.25; 32 -10.75,-6.75; 33 -10.75,-7.25; 34 -10.75,-7.75; 35 -10.75,-8.25; 36 -10.75,-8.75; 73 10.75,-8.75; 74 10.75,-8.25; 75 10.75,-7.75; 76 10.75,-7.25; 77 10.75,-6.75; 78 10.75,-6.25; 79 10.75,-5.75; 80 10.75,-5.25; 81 10.75,-4.75; 82 10.75,-4.25; 83 10.75,-3.75; 84 10.75,-3.25; 85 10.75,-2.75; 86 10.75,-2.25; 87 10.75,-1.75; 88 10.75,-1.25; 89 10.75,-0.75; 90 10.75,-0.25; 91 10.75,0.25; 92 10.75,0.75; 93 10.75,1.25; 94 10.75,1.75; 95 10.75,2.25; 96 10.75,2.75; 97 10.75,3.25; 98 10.75,3.75; 99 10.75,4.25; 100 10.75,4.75; 101 10.75,5.25; 102 10.75,5.75; 103 10.75,6.25; 104 10.75,6.75; 105 10.75,7.25; 106 10.75,7.75; 107 10.75,8.25; 108 10.75,8.75 | smd 0.3 x 1: 37 -8.75,-10.75; 38 -8.25,-10.75; 39 -7.75,-10.75; 40 -7.25,-10.75; 41 -6.75,-10.75; 42 -6.25,-10.75; 43 -5.75,-10.75; 44 -5.25,-10.75; 45 -4.75,-10.75; 46 -4.25,-10.75; 47 -3.75,-10.75; 48 -3.25,-10.75; 49 -2.75,-10.75; 50 -2.25,-10.75; 51 -1.75,-10.75; 52 -1.25,-10.75; 53 -0.75,-10.75; 54 -0.25,-10.75; 55 0.25,-10.75; 56 0.75,-10.75; 57 1.25,-10.75; 58 1.75,-10.75; 59 2.25,-10.75; 60 2.75,-10.75; 61 3.25,-10.75; 62 3.75,-10.75; 63 4.25,-10.75; 64 4.75,-10.75; 65 5.25,-10.75; 66 5.75,-10.75; 67 6.25,-10.75; 68 6.75,-10.75; 69 7.25,-10.75; 70 7.75,-10.75; 71 8.25,-10.75; 72 8.75,-10.75; 109 8.75,10.75; 110 8.25,10.75; 111 7.75,10.75; 112 7.25,10.75; 113 6.75,10.75; 114 6.25,10.75; 115 5.75,10.75; 116 5.25,10.75; 117 4.75,10.75; 118 4.25,10.75; 119 3.75,10.75; 120 3.25,10.75; 121 2.75,10.75; 122 2.25,10.75; 123 1.75,10.75; 124 1.25,10.75; 125 0.75,10.75; 126 0.25,10.75; 127 -0.25,10.75; 128 -0.75,10.75; 129 -1.25,10.75; 130 -1.75,10.75; 131 -2.25,10.75; 132 -2.75,10.75; 133 -3.25,10.75; 134 -3.75,10.75; 135 -4.25,10.75; 136 -4.75,10.75; 137 -5.25,10.75; 138 -5.75,10.75; 139 -6.25,10.75; 140 -6.75,10.75; 141 -7.25,10.75; 142 -7.75,10.75; 143 -8.25,10.75; 144 -8.75,10.75 | smd 4 x 4: E 0,0
2X20 = drill 1.016 octagon: 1 -24.13,-1.27; 2 -24.13,1.27; 3 -21.59,-1.27; 4 -21.59,1.27; 5 -19.05,-1.27; 6 -19.05,1.27; 7 -16.51,-1.27; 8 -16.51,1.27; 9 -13.97,-1.27; 10 -13.97,1.27; 11 -11.43,-1.27; 12 -11.43,1.27; 13 -8.89,-1.27; 14 -8.89,1.27; 15 -6.35,-1.27; 16 -6.35,1.27; 17 -3.81,-1.27; 18 -3.81,1.27; 19 -1.27,-1.27; 20 -1.27,1.27; 21 1.27,-1.27; 22 1.27,1.27; 23 3.81,-1.27; 24 3.81,1.27; 25 6.35,-1.27; 26 6.35,1.27; 27 8.89,-1.27; 28 8.89,1.27; 29 11.43,-1.27; 30 11.43,1.27; 31 13.97,-1.27; 32 13.97,1.27; 33 16.51,-1.27; 34 16.51,1.27; 35 19.05,-1.27; 36 19.05,1.27; 37 21.59,-1.27; 38 21.59,1.27; 39 24.13,-1.27; 40 24.13,1.27
2X10 = drill 1.016 octagon: 1 -11.43,-1.27; 2 -11.43,1.27; 3 -8.89,-1.27; 4 -8.89,1.27; 5 -6.35,-1.27; 6 -6.35,1.27; 7 -3.81,-1.27; 8 -3.81,1.27; 9 -1.27,-1.27; 10 -1.27,1.27; 11 1.27,-1.27; 12 1.27,1.27; 13 3.81,-1.27; 14 3.81,1.27; 15 6.35,-1.27; 16 6.35,1.27; 17 8.89,-1.27; 18 8.89,1.27; 19 11.43,-1.27; 20 11.43,1.27
0805 = smd 1.2 x 1: 1 -1.1,0; 2 1.1,0
CHIP-LED0805 = smd 1.2 x 1.2: A 0,-1.05; C 0,1.05
R0805 = smd 1.3 x 1.5: 1 -0.95,0; 2 0.95,0
DIL06 = drill 0.813 long: 1 -2.54,-3.81; 2 0,-3.81; 3 2.54,-3.81; 4 2.54,3.81; 5 0,3.81; 6 -2.54,3.81
BU-SMA-H = drill 1.27: 1 0,0 | drill 1.778: 2 -2.55,2.55; 3 2.55,2.55; 4 2.55,-2.55; 5 -2.55,-2.55

### Placement (x,y rotation side)
C100  82.55,33.33 90 top
C101  76.53,14.93 180 top
C102  76.7,24 0 top
C110  82.55,20.72 90 top
C111  76.51,28.41 180 top
C112  76.64,37.55 0 top
C113  33.16,20.17 180 bottom
C114  64.16,20.67 0 bottom
C115  64.16,36.67 0 bottom
C116  33.16,35.67 180 bottom
C120  82.55,6 90 top
C121  76.55,1.66 180 top
C122  76.55,10.43 0 top
C123  36.66,33.17 180 bottom
C124  61.16,26.67 0 bottom
C125  48.16,40.17 270 bottom
C126  53.16,16.67 90 bottom
C127  53.16,40.17 270 bottom
C128  61.16,33.17 0 bottom
C129  56.66,40.17 270 bottom
C130  44.66,16.67 90 bottom
C131  56.66,16.67 90 bottom
C132  48.16,16.67 90 bottom
C133  44.66,40.17 270 bottom
C134  36.66,26.67 180 bottom
C140  12,12 0 top
C141  12,14 0 top
C142  11,10 180 top
C143  17,12 0 top
C144  17,14 0 top
C145  16.5,10 180 top
C146  27.39,11.97 0 top
C147  27.39,13.97 0 top
C148  32.22,7.02 180 top
C149  26.39,9.97 180 top
C150  22.41,12 0 top
C151  22.41,14 0 top
C152  21.41,10 180 top
C160  82.55,46.98 90 top
C161  78.55,42.34 180 top
C162  76.69,51.25 0 top
C163  44.66,22.17 270 bottom
C164  53.66,34.67 90 bottom
C165  54.66,32.17 180 bottom
C166  44.66,34.67 90 bottom
C167  43.66,32.17 0 bottom
C168  53.66,22.17 270 bottom
C169  54.66,24.67 180 bottom
C170  43.66,24.67 0 bottom
C200  4.65,13.53 180 top
C201  13.28,20.98 180 top
C202  10,45 180 top
C203  10,43 0 top
C204  12.2,33.04 90 bottom
C205  15.46,30.39 180 top
C206  15.41,31.67 180 top
C207  18.43,33.1 135 bottom
C208  22.37,37 315 bottom
C209  21.62,34.14 225 top
C210  19.14,36.11 225 top
C211  15.63,26.6 0 top
C301  68.29,30.51 270 top
D1  12.5,44 90 top
F200  8.5,15.75 180 top
F201  4,15.75 180 top
F202  8.5,40 180 top
F203  4,40 180 top
IC100  76.55,19.62 90 top
IC101  76.55,5.93 90 top
IC102  76.55,32.87 90 top
IC103  76.55,46.56 90 top
IC200  27,29 180 top
IC300  34.39,11.84 90 top
IC301  65.57,30.25 180 top
IC400  49.16,28.28 180 top
JP1  32.57,52.61 0 top
JP2  45,3 180 top
L1  5,25.5 180 bottom
L140  13,7 90 top
L141  18,7 90 top
L142  27.89,6.97 90 top
L143  22.91,7 90 top
LED2V5  70.55,32.87 180 top
LED3V3A  70.55,5.87 180 top
LED3V3B  70.55,18.87 180 top
LED801  66,53 0 top
LED802  68,53 0 top
LED803  66,3 180 top
LED804  68,3 180 top
R100  73.55,42.17 0 top
R101  70.59,10.74 90 top
R102  70.69,23.49 90 top
R103  70.55,37.87 90 top
R201  15.75,28.04 180 top
R202  4,28 90 bottom
R203  6,28 90 bottom
R301  13.95,49.19 0 bottom
R302  10.45,49.15 0 bottom
R404  26.19,47.54 270 bottom
R405  67.67,23.4 270 top
R800  66,49 270 top
R801  68,49 270 top
R802  66,8 90 top
R803  68,8 90 top
T201  6,21 270 top
T202  6,34 270 top
X201  4.4,9 180 top
X202  4.4,46 180 top

### Tracks (layer width: path | path; a pad name or v marks a point on that pad's centre or on a via)
+1V2  (via drill 0.6)
  Top 0.254: IC400.73 41.2,37.03 | 41.2,37.03 41.3,37.03 | IC400.70 41.41,37.13 41.3,37.03 | 41.22,37.02 41.2,37.03 | IC400.78 v41.49,34.53 | v41.49,34.53 | IC400.84 41.46,31.53 v41.46,31.5 | IC400.102 v41.54,22.53 v41.55,22.52 41.55,21.27 40.41,20.12 IC400.109 | IC400.116 43.91,20.05 v43.92,20.06 | IC400.124 47.91,20.17 v47.94,20.2 | IC400.134 52.91,20.12 v52.93,20.14 | IC400.138 54.91,20.13 v54.89,20.14 54.96,20.2 56.57,20.2 57.24,19.53 IC400.1 | IC400.5 v56.78,21.53 v56.78,21.54 | IC400.45 53.91,37.06 v53.64,36.79 | IC400.34 57.55,36.03 v57.41,36.18 IC400.38 IC400.37 57.96,39.09 v57.96,41.96 | IC400.29 57.44,33.53 v56.72,33.52 | IC400.61 45.91,36.64 v45.92,36.62 | v41.49,34.53 41.49,36.84 41.3,37.03 | v62.84,43.32 63.71,43.32 70.46,43.32 71.24,42.57 71.24,41.04 71.53,40.74 74.05,40.74 74.5,41.19 R100.2
  Top 0.406: C161.2 77.53,42.17 R100.2 74.66,42.33 74.66,44.09 73.4,45.35 IC103.4 73.5,46.67 73.5,50.1 72.76,50.84 72.76,51.82 73.33,51.82 73.85,51.3 75.14,51.3 C162.+
  Bottom 0.254: 44.64,35.5 C166.2 | 43.43,21.3 44.65,21.3 C163.2 | 55.48,34.53 55.48,34.19 | 55.48,32.2 C165.2 | 53.7,21.36 C168.2 | C163.2 44.33,21.32 44.29,21.28 44.8,21.28 44.88,21.36 | 42.71,34.53 42.81,34.64 | 42.7,22.52 42.81,22.41 | v43.92,20.06 43.92,20.57 C163.2 | 47.94,21.29 47.91,21.32 | v52.93,20.14 52.93,20.58 C168.2 | v54.89,20.14 54.84,20.14 C168.2 | 53.64,35.54 C164.2 | v57.41,36.18 57.41,36.12 | v45.92,36.62 45.77,36.62
  Bottom 0.406: C167.2 C170.2 42.81,22.41 42.81,21.92 43.43,21.3 | C167.2 42.81,34.64 42.81,34.9 43.41,35.5 44.64,35.5 | 55.48,34.53 54.5,35.52 C164.2 C166.2 45.77,36.62 | 55.48,32.2 55.48,34.19 57.41,36.12 | 55.52,21.92 C169.2 C165.2 56.29,33.05 v56.72,33.52 | 55.52,21.92 54.95,21.36 53.7,21.36 | C168.2 47.91,21.32 C163.2 | v41.49,34.53 42.71,34.53 | v41.46,31.5 42.18,31.53 C167.2 | v41.55,22.52 42.7,22.52 | v47.94,20.2 47.94,21.29 | v56.78,21.54 55.9,21.54 55.52,21.92 | v53.64,36.79 53.64,35.54 | v62.84,43.32 59.34,43.34 v57.96,41.96
+2V5  (via drill 0.6)
  Top 0.254: IC400.107 v35.27,20.03 v35.26,20.04 | IC400.75 36.16,36.03 v35.28,36.76 | IC400.35 62.06,36.53 v62.1,36.55 | IC400.3 62.01,20.53 v62.02,20.51
  Top 0.406: IC102.4 73.4,32.38 | 73.4,32.38 73.4,31.7 | 73.4,31.7 73.4,29.53 74.5,28.42 75.65,28.42 C111.2 | R103.2 74.85,38.82 75.19,38.48 75.19,37.59 C112.+ 73.64,37.55 73.26,37.16 73.26,32.51 73.4,32.38 | v71.81,27.91 71.81,30.11 73.4,31.7
  Bottom 0.254: 34.05,20.14 C113.2 34.14,20.04 v35.26,20.04 | 63.41,36.92 63.31,36.83 63.31,36.7 | 63.31,36.7 63.57,36.44 | 63.21,36.55 C115.2 | 63.17,20.53 C114.2 | 63.35,18.22 63.31,18.25 | 63.31,36.7 C115.2 | C115.2
  Bottom 0.406: C113.2 C116.2 34.02,36.28 34.5,36.76 v35.28,36.76 | 34.05,20.14 34.05,18.03 37.52,14.57 42.15,14.57 43.7,13.03 60.48,13.03 62.03,14.57 63.31,15.88 63.31,18.25 C114.2 63.31,22.08 | C115.2 63.31,22.08 | v62.1,36.55 63.21,36.55 | v62.02,20.51 63.17,20.53 | v71.81,27.91 71.83,22.08 71.1,22.08 63.31,22.08
+3V3  (via drill 0.6)
  Top 0.406: v14.49,46.68 | v14.49,46.68 12.13,49.04 9.69,49.04 8.44,50.28 JP1.1
  Bottom 0.406: R203.2 6,29.86 7.48,31.34 7.48,36.89 8.64,38.05 8.64,39.14 10.58,41.07 10.58,46.62 9.5,47.7 R302.2 8.44,50.21 JP1.1 | R301.2 13,48.17 v14.49,46.68
+3V3A  (via drill 0.4, 0.6)
  Top 0.254: IC400.81 38.32,33.03 38.27,33.09 v41.12,33.09 | IC400.93 41.09,27.03 v41.1,27.01 | IC400.117 44.41,19.06 v45.39,20.04 46.91,18.52 IC400.122 | IC400.130 50.91,19.56 v50.15,20.32 | IC400.139 55.41,15.84 v55.42,15.83 | v57.87,27.54 57.88,27.53 IC400.17 63.1,27.53 IC301.4 IC301.1 | IC400.26 57.81,32.03 v57.8,32.05 | IC400.62 45.41,38.29 44.63,37.52 v44.63,36.94 | IC400.56 48.41,37.08 v48.15,36.83 | IC400.47 52.91,37.66 v52.09,36.85 | IC400.40 56.41,37.25 v55.83,36.67 | 67.67,18.23 70.72,15.17 62.34,15.17 v61.14,16.37 | IC103.3 81.31,48.86 | v69.34,12.83 69.45,12.83 | v33.98,38.91 37.64,38.91 v37.86,38.88
  Top 0.406: C121.2 75.7,4.75 74.67,5.78 73.56,5.78 IC101.4 73.4,7.28 75.03,8.92 75.03,10.42 C122.+ 74.9,10.58 73.24,10.58 72.13,11.69 R101.2 | R405.2 67.67,18.23 70.61,15.29 70.61,11.7 R101.2 | C160.2 82.55,48.46 82.19,48.83 79.73,48.83 IC103.3 | 81.31,48.86 v82.39,49.95 | 69.45,12.83 R101.2 | C301.2 67.23,29.66 IC301.1
  Bottom 0.254: 56.74,39.24 C129.2 | C123.2 37.6,33.09 | C134.2 37.86,27.01 | C130.2 C132.2 48.7,17.52 48.68,17.53 | 50.15,17.55 50.12,17.52 | v57.87,27.54 59.45,27.54 C124.2 | 44.63,39.28 C133.2 | 48.15,39.3 C125.2 | 60.31,18.19 60.16,18.04 | 56.81,17.55 56.69,17.68 | 56.69,17.68 | 56.69,17.68 56.46,17.45
  Bottom 0.305: v61.14,16.37 61.14,17.06 60.16,18.04
  Bottom 0.406: C128.2 C124.2 60.31,18.19 | C128.2 60.31,38.07 59.14,39.24 56.74,39.24 | C127.2 C129.2 55.83,38.48 v55.83,36.67 | C127.2 C125.2 C133.2 39.33,39.32 38.65,38.63 | 38.65,38.63 37.51,37.49 C123.2 C134.2 37.51,19.29 39.27,17.53 48.68,17.53 | 48.7,17.52 50.12,17.52 C126.2 C131.2 55.42,16.27 v55.42,15.83 | v41.12,33.09 37.6,33.09 | v41.1,27.01 37.86,27.01 | v45.39,20.04 45.39,18.24 C130.2 | v50.15,20.32 50.15,17.55 | v57.8,32.05 59.19,32.05 C128.2 | v44.63,36.94 44.63,39.28 | v48.15,36.83 48.15,39.3 | v52.09,36.85 52.09,38.24 C127.2 | R404.2 26.19,44.87 26.45,44.61 28.28,44.61 v33.98,38.91 | 60.16,18.04 59.67,17.55 56.81,17.55 | v82.39,49.95 82.39,18.5 75.74,11.85 70.31,11.85 v69.34,12.83 | v37.86,38.88 38.15,39.13 38.65,38.63
+3V3B  (via drill 0.6)
  Top 0.254: v73.61,15.15 73.61,19.41 IC100.4
  Top 0.305: 31.23,0.65 57.3,0.64 v58.59,1.78
  Top 0.406: L140.1 L141.1 L143.1 27.86,5.9 L142.1 27.89,3.98 31.23,0.65 | C101.2 73.83,14.93 v73.61,15.15 | v59.48,9.93 59.48,6.61 58.65,5.78 58.65,1.83 v58.59,1.78 | R102.2 72.61,24.44 73.04,24.02 75.19,24.02 C102.+ 75.19,20.21 74.6,19.62 IC100.4
  Bottom 0.254: 73.56,15.1 v73.61,15.15 | 65.73,9.95 65.72,9.95
  Bottom 0.406: 65.72,9.95 v59.48,9.93 | 73.56,15.1 70.31,15.1 68.29,13.25 68.29,10.31 67.94,9.95 65.73,9.95
+5V  (via drill 0.6)
  Top 0.406: 9.77,53.88 9.75,53.91 9.75,55.27 83.75,55.22 84.07,54.9 84.07,35.7 84.15,35.7 84.15,33.96 | C120.2 82.55,7.69 | 82.55,7.69 81.97,8.27 79.73,8.27 IC101.3 79.6,8.33 79.6,9.05 80.06,9.52 v81.79,9.52 84.09,9.52 84.09,9.51 | 84.2,9.34 84.15,9.29 | 84.15,9.29 82.55,7.69 | C100.2 82.55,34.87 | 82.55,34.87 82.07,35.35 79.88,35.35 IC102.3 | 84.15,33.96 84.15,21.68 | 84.15,21.68 84.15,9.29 | 82.55,34.87 82.59,34.87 82.59,33.96 84.15,33.96 | IC100.3 81.05,21.92 81.4,21.57 82.54,21.57 C110.2 84.04,21.57 84.15,21.68
  Top 0.813: JP1.4 9.77,53.88 JP1.2 | JP2.2 JP2.1
  Bottom 0.406: R202.2 4.29,29.25 4.29,29.71 6,31.42 6,38.91 7.57,40.48 8.73,40.48 9.79,41.54 9.79,45.89 9.7,45.98 7.02,45.98 4.43,48.57 4.43,50.09 5.8,51.22 5.8,52.81 7.3,53.88 JP1.2 | JP2.1 56.43,6.83 57.65,8.05 80.33,8.05 v81.79,9.52
AVDD_ADC  (via drill 0.6)
  Top 0.254: IC200.40 22.59,29.23 17.94,29.23 v17.8,29.38 | v19.88,31.76 22.59,31.76 IC200.35
  Top 0.406: L140.2 13,8.61 12.57,9.05 12.57,9.93 C142.+ 12.5,10.55 12.89,10.94 12.89,11.96 C140.2 C141.2 12.85,16.25 13.57,16.97 16.32,16.97 v16.61,17.27
  Bottom 0.406: v16.61,17.27 16.61,27.73 16.62,28.45 16.86,28.45 v17.8,29.38 17.8,29.68 v19.88,31.76
AVDD_DAC  (via drill 0.6)
  Top 0.254: IC200.43 20.86,27.75 v20.38,27.27
  Top 0.406: v17.85,15.25 C144.2 C143.2 17.85,10.15 C145.+ L141.2
  Bottom 0.406: v20.38,27.27 20.38,27 17.86,24.48 17.86,15.13 v17.85,15.25
CLK
  Top 0.254: IC200.57 27.25,21.56 27.25,20.75 27.25,19.81 28.25,18.8 29.83,18.8 32.28,16.36 IC300.4
CLKVDD  (via drill 0.6)
  Top 0.254: v28.08,21.5 28.08,21.57 27.74,21.92 27.74,24.6 IC200.58
  Top 0.406: v27.77,16.01 28.24,15.54 C147.2 C146.2 28.24,10.97 27.89,10.62 C149.+ L142.2 29.8,8.07 29.88,7.99 | IC300.6 30.58,9.3 29.88,8.6 29.88,7.99 | 29.88,7.99 29.88,7.63 30.42,7.09 31.3,7.09 C148.2
  Bottom 0.406: v27.77,16.01 27.77,21.19 v28.08,21.5
DEBUG_1  (via drill 0.4, 0.6)
  Top 0.254: IC400.30 64.63,34.03 65.95,35.35 65.95,35.39 68.49,37.93 68.49,41.51 v69.27,42.28 | 65.95,48.01 R800.2 65.98,48.03
  Top 0.406: v65.98,46 65.98,48.03
  Bottom 0.406: v69.27,42.28 69.27,42.72 v65.98,46
DEBUG_2  (via drill 0.4, 0.6)
  Top 0.254: IC400.28 66.48,33.03 69.13,35.68 69.13,40.47 70.28,41.62 v70.31,41.62 | 68.11,47.94 R801.2 | 68.11,45.5 v68.17,45.44
  Top 0.406: 68.11,47.94 68.11,45.5
  Bottom 0.254: 70.28,41.64 v70.31,41.62
  Bottom 0.406: v68.17,45.44 68.17,44.72 70.28,42.61 70.28,41.64
DEBUG_3  (via drill 0.6)
  Top 0.254: IC400.4 61.21,21.03 61.35,21.18 61.35,21.19 61.47,21.3 62.54,21.3 66.03,17.81 v66.03,16.12 | v66,13.72 v66,13.73
  Top 0.406: R802.2 v66,13.72
  Bottom 0.254: 66,16.09 v66.03,16.12
  Bottom 0.406: v66,13.73 66,16.09
DEBUG_4  (via drill 0.6)
  Top 0.254: IC400.6 62.55,22.03 67.77,16.81 v68,16.58 | 68,14.26 v68.01,14.27
  Top 0.406: R803.2 68,14.26
  Bottom 0.254: 68.01,16.57 v68,16.58
  Bottom 0.406: v68.01,14.27 68.01,16.57
DVDD  (via drill 0.6)
  Top 0.254: IC200.60 28.75,22.65 v28.73,22.64 | IC200.64 30.75,23.16 | 30.75,23.16 30.75,22.65 v30.73,22.64 30.73,23.14 30.75,23.16 | IC200.17 30.75,34.84 v31.05,35.09
  Top 0.406: v23.26,15.31 23.26,15.1 C151.2 C150.2 23.27,11.98 23.27,11.07 22.91,10.7 C152.+ L143.2
  Bottom 0.406: v28.73,22.64 29.92,22.64 | 29.92,22.64 v30.73,22.64 31.05,23.22 v31.05,35.09 | 29.92,22.64 29.81,22.52 29.81,15.86 29.07,15.12 23.45,15.12 v23.26,15.31
FPGA_ADIO00
  Top 0.254: IC200.12 33.76,30.75 35.04,32.03 IC400.83
FPGA_ADIO01
  Top 0.254: IC200.11 34.15,30.25 34.93,31.03 IC400.85
FPGA_ADIO02
  Top 0.254: IC400.86 35.19,30.53 34.41,29.75 IC200.10
FPGA_ADIO03
  Top 0.254: IC200.9 34.64,29.25 35.42,30.03 IC400.87
FPGA_ADIO04
  Top 0.254: IC400.98 37.6,24.55 34.12,28.75 IC200.8
FPGA_ADIO05
  Top 0.254: IC400.99 37.43,24.04 33.95,28.24 IC200.7
FPGA_ADIO06
  Top 0.254: IC400.100 37.23,23.54 33.77,27.74 IC200.6
FPGA_ADIO07
  Top 0.254: IC400.101 37.06,23.04 33.58,27.25 IC200.5
FPGA_ADIO08
  Top 0.254: IC400.103 37.19,22.04 33.42,26.74 IC200.4
FPGA_ADIO09
  Top 0.254: IC200.3 33.19,26.24 36.98,21.54 IC400.104
FPGA_ADIO10
  Top 0.254: IC200.2 32.97,25.75 36.71,21.03 IC400.105
FPGA_ADIO11
  Top 0.254: IC200.1 32.8,25.25 36.46,20.53 IC400.106
FPGA_CE0_SPI0
  Top 0.254: IC400.43 54.91,43.75 50.46,48.19 39.62,48.19 37.64,50.17
  Top 0.406: 37.64,50.17 37.64,52.63 JP1.24
FPGA_CE0_SPI1
  Top 0.254: IC400.50 51.41,43.47 48.52,46.35 25.51,46.35 22.43,49.43
  Top 0.406: 22.43,49.43 22.43,52.59 JP1.12
FPGA_CE1_SPI0
  Top 0.254: IC400.42 55.41,43.91 50.56,48.75 41.25,48.75 40.13,49.87
  Top 0.406: 40.13,49.87 40.13,52.67 JP1.26
FPGA_CE1_SPI1
  Top 0.254: IC400.51 50.91,43.25 48.03,45.93 24.22,45.93 21.09,49.06 | 21.09,51.29 JP1.11
  Top 0.406: 21.09,49.06 21.09,51.29
FPGA_CE2_SPI1
  Top 0.254: 54.68,48.43 54.91,48.07 63.32,39.66 63.45,36.33 62.38,35.49 IC400.33
  Top 0.406: JP1.36 51.82,53.88 52.88,52.82 52.88,50.23 54.68,48.43
FPGA_CLKOUT
  Top 0.254: IC200.19 29.75,36.61 32.77,39.62 40.13,39.62 40.41,39.35 IC400.72
FPGA_CLOCK
  Top 0.254: IC400.25 64.53,31.53 IC301.3
FPGA_CONF_DONE  (via drill 0.6)
  Top 0.254: IC400.92 36.87,27.53 v35.7,28.7
  Top 0.406: v24.64,48.87 25.4,48.87 26.13,49.6 26.13,51.25 JP1.15
  Bottom 0.254: v35.7,28.7 35.7,28.72 | 26.23,48.54 R404.1
  Bottom 0.305: 35.13,35.38 36.4,36.65 36.4,40.57 28.42,48.54
  Bottom 0.406: 35.7,28.72 34.76,29.71 34.76,34.23 35.13,34.93 35.13,35.38 | 28.42,48.54 26.23,48.54 24.97,48.54 v24.64,48.87
FPGA_DATA[0]  (via drill 0.6)
  Top 0.254: IC400.13 64.72,25.53 66.33,27.14 67.53,27.14 v67.61,27.22
  Bottom 0.254: JP1.33 49.23,51.34 51.83,48.74 61.3,48.74 67.61,42.43
  Bottom 0.406: 67.61,42.43 v67.61,27.22
FPGA_DCLK  (via drill 0.6)
  Top 0.254: v65.76,25.03 64.76,25.03 64.07,25.03 IC400.12
  Bottom 0.254: JP1.18 28.9,53.88 | 30.94,48.42 | 61.02,48.19 66.78,42.46 66.78,27.7 65.76,26.68
  Bottom 0.406: 28.9,53.88 29.97,52.81 29.97,49.39 30.94,48.42 | 30.94,48.42 31.17,48.19 61.02,48.19 | v65.76,25.03 65.76,26.68
FPGA_MISO_SPI0
  Top 0.254: IC400.46 53.41,43.59 49.66,47.34 35.74,47.34 33.79,49.29 | 33.79,51.29 JP1.21
  Top 0.406: 33.79,49.29 33.79,51.29
FPGA_MISO_SPI1
  Top 0.254: IC400.39 56.91,43.94 51.69,49.15 | 51.69,51.28 JP1.35
  Top 0.406: 51.69,49.15 51.69,51.28
FPGA_MODE  (via drill 0.6)
  Top 0.254: IC400.110 40.91,15.02 v38.75,12.85 | v19.17,12.09 19.17,15.17 21.13,17.13 22.54,17.13 25.25,19.84 IC200.53
  Bottom 0.254: v38.75,12.85 38.98,13.08
  Bottom 0.406: 38.98,13.08 37.67,11.77 19.43,11.77 v19.17,12.09
FPGA_MOSI_SPI0
  Top 0.254: IC400.49 51.91,43.8 48.84,46.87 33.46,46.87 31.36,48.97 | 31.36,51.29 JP1.19
  Top 0.406: 31.36,48.97 31.36,51.29
FPGA_MOSI_SPI1
  Top 0.254: IC400.32 62.92,35 64.07,35.94 63.9,39.97 58.09,46.05 58.15,52.18 57.87,52.68
  Top 0.406: JP1.38 54.16,53.62 55.33,52.68 57.87,52.68
FPGA_NCONFIG  (via drill 0.6)
  Top 0.254: v64.65,27.14 | v64.65,27.14 63.53,26.03 IC400.14
  Bottom 0.254: 60.87,47.47 66.26,42.08 66.26,28.76
  Bottom 0.406: JP1.13 24.61,51.34 24.93,51.01 24.93,50.17 25.32,49.78 28.7,49.78 31.02,47.47 60.87,47.47 | 66.26,28.76 v64.65,27.14
FPGA_NSTATUS  (via drill 0.6)
  Top 0.254: v67.88,25.8 67.88,25.74 67.84,25.05 67.84,24.52 R405.1 67.58,24.26 66.69,24.26 65.96,23.53 IC400.9
  Bottom 0.254: JP1.37 54.16,50.11 54.96,49.31 61.56,49.31 68.1,42.78 68.47,42.4 68.47,26.38 | v67.88,25.8 v67.89,25.8
  Bottom 0.406: v67.89,25.8 68.47,26.38
FPGA_PGA0
  Top 0.254: IC200.29 24.75,38.78 30.8,44.84 45.28,44.84 46.91,43.22 IC400.59
FPGA_PGA1
  Top 0.254: IC200.28 25.25,38.57 31.07,44.37 44.93,44.37 46.41,42.9 IC400.60
FPGA_PGA2
  Top 0.254: IC200.27 25.75,38.42 31.3,43.96 42.04,43.96 44.41,41.62 IC400.64
FPGA_PGA3
  Top 0.254: IC200.26 26.25,38.23 31.54,43.52 41.71,43.52 43.91,41.32 IC400.65
FPGA_PGA4
  Top 0.254: IC200.25 26.75,38.07 31.78,43.1 41.41,43.08 43.41,41.07 IC400.66
FPGA_PGA5
  Top 0.254: IC200.24 27.25,37.97 31.94,42.65 41.16,42.65 42.91,40.91 IC400.67
FPGA_RESET
  Top 0.254: IC200.30 24.25,38.99 30.62,45.36 45.7,45.36 47.41,43.66 IC400.58
FPGA_RXCLK
  Top 0.254: IC200.16 32.54,32.75 35.32,35.53 IC400.76
FPGA_RXEN
  Top 0.254: IC200.13 33.46,31.25 35.74,33.53 IC400.80
FPGA_SCLK
  Top 0.254: IC200.22 28.25,37.39 32,41.15 41.66,41.15 42.41,40.4 IC400.68
FPGA_SCLK_SPI0
  Top 0.254: IC400.44 54.41,43.47 50.11,47.77 37.88,47.77 36.38,49.26 | JP1.23
  Top 0.406: 36.38,49.26 JP1.23
FPGA_SCLK_SPI1
  Top 0.254: 58.7,53.29 58.62,46.37 64.57,40.14 64.7,35.6 63.33,34.53 IC400.31
  Top 0.406: JP1.40 58.1,53.88 58.7,53.29
FPGA_SDIO
  Top 0.254: 40.88,39.41 IC400.71 40.89,39.04 40.89,39.88 40.64,40.13 32.51,40.13 29.25,36.87 IC200.20
FPGA_SDO
  Top 0.254: IC400.69 41.88,39.5
  Top 0.256: IC200.21 28.75,37.13 32.26,40.64 41.15,40.64 41.91,39.88 IC400.69
FPGA_SEN  (via drill 0.25)
  Top 0.254: IC400.7 64.77,22.53 v65.06,22.82 | v61.39,45.63 62.9,44.13 v70.26,44.13 | IC200.23 27.75,37.66 32,41.91 36.11,41.91 v36.21,41.8
  Bottom 0.15: 61.37,45.62 61.38,45.63 v61.39,45.63 v61.4,45.62 61.4,45.61 61.36,45.61
  Bottom 0.254: v36.21,41.8 40.11,45.61 61.36,45.61 | v65.06,22.82 67.88,22.82 71.01,25.95 70.87,39.12 71.37,39.62 71.37,42.16 70.95,42.59 70.95,42.98 70.97,43.45 v70.26,44.13
FPGA_TXCLK
  Top 0.254: IC200.15 32.98,32.25 35.76,35.03 IC400.77
FPGA_TXEN
  Top 0.254: IC200.14 33.21,31.75 35.49,34.03 IC400.79
GND  (via drill 0.6, 2)
  Top 0.254: IC400.95 IC400.94 39.28,26.53 40.23,25.58 44.02,25.58 46.69,28.25 47.41,28.25 | IC400.97 IC400.96 | IC400.108 36.72,19.53 36.38,19.19 36.38,14.48 IC300.3 36.49,15.78 33.92,18.35 32.19,18.35 | IC400.123 47.41,19.26 46.5,20.17 46.5,25.62 48.3,27.42 | 48.3,27.42 IC400.E | 47.41,28.25 47.44,28.28 | 48.3,27.42 48.24,27.42 47.41,28.25 | IC200.36 24.75,31.25 | 24.75,31.25 26.14,29.86 | 26.14,29.86 IC200.65 | IC200.39 26.03,29.75 26.14,29.86 | IC200.44 25.25,27.25 | 25.25,27.25 25.64,27.64 | 25.64,27.64 26.25,28.25 | 25.25,27.25 23.75,25.75 IC200.47 IC200.48 20.64,25.25 20.27,24.89 20.27,23.77 v20.35,23.7 v20.35,20.9 | IC200.54 25.75,27.54 25.64,27.64 | IC200.55 26.25,28.25 | 26.25,28.25 IC200.65 | 28.25,27.75 29.75,26.25 IC200.62 29.74,24.59 29.74,23.73 29.83,23.64 29.83,20.71 32.19,18.35 | IC200.59 28.25,27.75 | 28.25,27.75 IC200.65 | IC200.31 23.75,32.25 24.75,31.25 | 24.75,31.25 24.75,31.69 24.81,31.76 24.32,32.25 IC200.34 21.2,32.24 20.39,32.91 17.4,32.91 14.71,35.6 11.22,39.1 8.55,39.1 F202.2@2 | IC200.63 30.25,25.71 26.92,29.04 26.92,29.07 30.25,32.41 IC200.18 30.26,33.41 30.26,36.12 32.02,37.54 35.98,37.55 36.55,36.53 IC400.74 39.76,36.53 v40.2,36.09 | 67.43,31.5 67.6,31.33 | 68.25,31.33 C301.1 | LED2V5.C | C141.1 11.15,14.04 11.22,14.11 | IC400.131 51.41,15.8 v50.53,15.82 | IC400.E 51.02,26.42 51.02,25.56 55.9,20.68 57.48,20.68 58.13,20.03 IC400.2 61.13,20.03 61.84,19.32 | IC400.140 55.91,18.47 56.26,18.82 58.26,18.82 58.93,18.15 61.33,18.15 | IC400.36 60.81,37.03 61.28,37.5 61.28,40.3 v60.87,40.71 | IC400.82 39.98,32.53 40.2,32.3 47.86,32.3 49.22,30.95 49.22,29.32 | 49.22,29.32 49.22,28.34 IC400.E
  Top 0.254: IC400.21 50.55,29.53 | 50.55,29.53 50.39,29.53 | 50.39,29.53 v49.19,28.33 | IC400.19 49.41,28.53 IC400.E | IC301.2 66.54,31.52 66.54,32.2 66.21,32.53 IC400.27 58.75,32.53 58.41,32.88 57.28,32.88 56.94,32.54 54.46,32.54 54.01,32.99 | v68.99,18.68 68.99,18.21 69.45,17.75 70.48,17.75 LED3V3B.C | IC400.57 47.91,41.17 v49.24,42.5 | 50.39,29.53 50.78,29.92 50.78,36.96 51.62,37.8 52.21,37.8 52.41,37.99 IC400.48 | IC400.41 55.91,37.97 55.61,37.67 55.41,37.67 54.67,36.94 54.67,33.65 54.01,32.99 | 54.01,32.99 50.55,29.53 | IC400.63 44.91,38.39 44.68,38.16 44.22,38.16 43.46,37.4 43.46,36.47 | 43.46,36.47 43.46,36.06 45.7,33.82 48.58,33.82 49.26,33.14 49.26,29.36 49.22,29.32 | 61.84,19.32 61.84,18.66 61.33,18.15 | 61.84,19.32 62.22,19.32 62.9,18.65 63.6,18.65 v64.9,17.35 | 72.62,42.19 R100.1 | IC400.118 44.91,14.17 v44.48,13.91 | 61.33,18.15 61.33,18.03 v61.88,17.48 | 32.19,18.35 32.19,17.93 v32.51,17.61 | v25.11,2.36 19.83,2.36 14.43,2.36 12.3,2.36 8.27,6.38 | v5.89,17.65 5.89,18.57 5.73,18.74 | v9.82,25.21 9.82,26.45 9.98,26.6 | v9.78,28.62 9.78,26.66 9.71,26.6 | v42.6,36.6 43.33,36.6 43.46,36.47
  Top 0.305: 15.52,36.06 15.52,36.07 | 14.71,35.6 15.17,36.06 15.51,36.06 v17.29,37.84 | v20.32,2.44 19.91,2.44 19.83,2.36 | 30.25,32.41 30.25,32.01 v29.19,30.95 | 26.14,29.86 26.14,30.02 v25.54,30.62 | 28.25,27.75 28.25,27.74 v28.32,27.67 | 25.25,27.25 25.25,27.34 v25.34,27.43 | v15.13,2.44 14.51,2.44 14.43,2.36 | 49.41,28.53 49.39,28.53 v49.19,28.33
  Top 0.406: IC400.96 IC400.95 | F200.2@2 F200.2@1 | R201.2 14.8,26.62 C211.1 9.98,26.6 9.71,26.6 9.09,26.6 7.64,25.15 7.64,23.41 | 7.64,23.41 7.64,22.88 8.28,22.24 13.81,22.24 14.18,21.86 14.18,21.04 C201.1 14.13,19.99 13.92,19.78 7.99,19.78 7.29,19.08 7.29,18.63 | 7.29,18.63 7.29,17 7.61,16.68 8.42,16.68 F200.2@1 | 7.29,18.63 7.19,18.74 5.73,18.74 5.13,18.74 4,17.61 F201.2@1 F201.2@2 3.81,14.71 2.42,14.71 1.85,14.13 X201.4 X201.3 X201.2 7.02,6.38 8.27,6.38 8.91,7.02 14.55,7.02 15.01,7.48 | T201.1 7.51,23.54 7.64,23.41 | X201.5 6.95,10.33 7.35,9.93 9.43,9.93 C142.- 9.55,10.05 9.55,11.45 10.1,12 C140.1 C141.1 | 4.05,43.45 X202.3 X202.4 X202.5 8.74,46.76 12.42,46.76 12.5,46.68 D1.B | 4.05,43.45 X202.2 6.95,41.38 7.41,40.92 8.43,40.92 F202.2@1 F202.2@2 | 4.05,43.45 4,43.4 F203.2@1 F203.2@2 4,38.27 4.62,37.66 4.62,33.1 3.01,31.5 2.23,31.5 T202.3 | LED801.C LED802.C | C147.1 C146.1 25.33,11.97 25.07,11.71 25.07,10.15 | 25.07,10.15 C149.- | C151.1 C150.1 20.26,12 19.91,11.64 C152.- | C152.- | C144.1 C143.1 16.15,10.26 15.9,10.01 C145.- | C145.- | IC301.2 67.43,31.5 | 67.6,31.33 68.25,31.33 | C301.1 69.07,31.36 69.52,31.82 LED2V5.C | LED803.C LED804.C 69.18,1.95 70.36,3.13 | 70.36,3.13 70.55,3.31 LED3V3A.C | 11.22,14.11 11.22,16.36 10.77,16.8 9.27,16.8 9.04,16.58 8.52,16.58 F200.2@1 | C145.- 15.01,7.48 | C152.- 19.91,7.21 | 19.91,7.21 19.72,7.02 15.46,7.02 15.01,7.48 | 25.07,10.15 25.07,7.34 | 25.07,7.34 24.78,7.05 20.07,7.05 19.91,7.21 | 25.07,7.34 25.93,7.34 26.26,7.02 28.92,7.02 31.71,4.23 33.53,4.23 JP2.19 33.08,4.76 C148.1 | 77.73,3.48 77.4,3.14 C121.1 77.4,1.13 76.99,0.72 72.77,0.72 70.36,3.13
  Top 0.406: 77.73,3.48 77.9,3.65 79.68,3.65 IC101.1 82,3.63 82.52,4.16 82.52,5.12 C120.1 | C101.1 79.28,14.93 | 79.28,14.93 79.69,14.52 79.69,11.97 79.58,11.97 C122.- 78.05,9.57 76.64,8.16 76.64,4.73 77.73,3.64 77.73,3.48 | C110.1 82.55,18.12 81.81,17.39 79.76,17.39 IC100.1 | 79.28,14.93 79.49,14.93 79.95,15.4 79.95,17.06 IC100.1 | C100.1 82.55,31.43 81.75,30.63 79.77,30.63 IC102.1 | IC100.1 79.66,17.35 78.05,17.35 77.23,18.17 77.23,22.29 77.96,23.02 77.96,23.77 C102.- 78.08,24.13 78.08,26.79 77.36,27.51 C111.1 79.31,28.41 79.77,28.87 79.77,30.49 IC102.1 | IC103.1 79.7,42.64 C161.1 79.43,42.31 79.43,40.59 78.14,39.3 C112.- 78.12,37.52 78.12,36.61 77.42,35.91 77.42,30.91 77.77,30.57 IC102.1 | IC103.1 81.83,44.26 82.51,44.94 82.51,46.09 C160.1 | LED802.C 64.15,54.05 v64.08,53.99 | 69.29,45.36 69.29,52.76 68.05,54 | 71.18,45.41 72.62,43.54 72.62,42.19 | IC200.65 26.96,29 26.92,29.04 | IC103.1 79.64,44.32 78.09,44.32 77.29,45.12 77.29,49.45 78.19,50.34 C162.- 78.19,52.91 77.1,54 68.05,54 | 68.05,54 LED802.C
  Top 0.813: JP2.20 JP2.19
  Bottom 0.254: 44.52,33.67 C166.1 | 53.66,32.32 C165.1 | 44.52,23.17 C163.1 | 53.66,24.52 C169.1 | C132.1 C130.1 44.48,15.63 | 44.48,41.2 C133.1 | C129.1 C127.1 | 61.95,33.23 C128.1 | 61.95,26.73 C124.1 62.1,26.58 | 56.74,15.74 C131.1 56.66,15.78 | 44.88,15.82 44.69,16.01 | C123.1 35.81,32.78 | 36.26,27.11 C134.1 | 35.53,15.74 | v50.53,15.82 50.53,15.8 50.79,15.82 | 49.24,41.04 49.26,41.02 | 61.41,38.8 61.28,38.92 | 62.6,17.72 62.53,17.79 | 35.65,26.49 35.8,26.64 35.97,26.64 36.04,26.72 | 64.9,20.55 C114.1 | 40.17,41.24 40.21,41.2 | v17.29,37.84 17.17,37.84 | 32.51,18.7 32.54,18.73 | 19.56,44.86 v19.65,44.76 19.65,44.65 | 22.59,41.82 v22.71,41.7 | 16.82,41.82 v16.8,41.8 | 16.8,39.78 16.77,39.74
  Bottom 0.305: 36.87,36.19 36.87,40.49 37.62,41.24 | 60.12,40.31 61.28,39.15 61.28,38.92 61.28,34.66 61.95,33.99 61.95,33.23 | 56.74,15.74 59.99,15.74 60.6,15.13 61.45,15.13 62.6,16.29 62.6,17.72 | 62.1,26.58 62.1,25.3 61.03,24.22 61.03,19.29 62.53,17.79 62.22,17.48 v61.88,17.48
  Bottom 0.406: 44.52,33.67 C167.1 C170.1 44.52,23.17 | C166.1 C164.1 53.66,32.32 | C163.1 C168.1 53.66,24.52 | C123.1 35.81,35.3 36.87,36.19 | 40.21,41.2 44.48,41.2 | C133.1 C125.1 49.26,41.02 C127.1 | C129.1 59.41,41.02 60.12,40.31 60.53,40.71 v60.87,40.71 | 61.95,33.23 61.95,26.73 | 56.66,15.78 56.03,14.75 53.92,14.75 C126.1 50.79,15.82 C132.1 44.88,15.82 | C116.1 C113.1 32.31,18.96 32.54,18.73 35.53,15.74 | 35.81,32.78 36.84,31.76 36.84,28.07 36.26,27.49 36.26,27.11 | JP1.6 13.52,52.95 | 13.52,52.95 13.31,52.73 13.14,52.73 13.01,52.6 7.55,52.6 6.6,51.54 6.6,49.35 X202.5 | 13.52,52.95 13.52,52.67 17.27,52.67 JP1.9 19.81,52.55 22.35,52.55 JP1.14 24.95,55.15 30.04,55.15 JP1.20 31.48,53.88 32.75,55.15 37,55.15 37.61,54.53 | 37.61,54.53 37.61,53.44 38.89,52.16 38.89,51.38 JP1.25 | 37.61,54.53 38.23,55.16 43.28,55.16 44,54.44 JP1.30 44.05,53.88 45.36,55.19 47.77,55.19 JP1.34 49.08,53.98 50.27,55.16 52.38,55.16 52.9,54.65 52.9,53.46 53.76,52.59 54.66,52.59 55.91,51.34 JP1.39 58.13,51.34 58.74,51.95 58.74,53.4 59.7,54.64 62.34,54.64 63.16,53.99 v64.08,53.99 | 35.53,15.74 37.42,13.85 40.04,13.85 40.36,13.53 40.36,13.15 | 40.36,13.15 40.36,11.96 36.38,7.99 35.05,7.99 33.66,6.59 33.66,5.06 33.22,4.62 JP2.19 | C207.1 17.82,32.66 14.81,35.67 14.81,37.79 16.02,38.99 | 16.02,38.99 16.77,39.74 20.82,39.74 C208.1 | 40.39,13.12 40.36,13.15 | C114.1 67,20.67 v68.99,18.68 | v49.24,42.5 49.24,41.04 | C115.1 65.02,37.88 64.1,38.8 61.41,38.8 | 44.69,16.01 38.19,16.01 36.38,17.82 36.38,24.86 35.65,25.6 35.65,26.49 | v64.9,17.35 64.9,20.55 | 37.62,41.24 40.17,41.24 | v44.48,13.91 44.48,15.63 | 17.17,37.84 16.02,38.99
  Bottom 0.406: v32.51,17.61 32.51,18.7 | C204.1 12.2,16.8 X201.5 | C165.1 53.81,30.1 52.25,28.53 49.39,28.53 v49.19,28.33 | v19.56,47.52 19.56,44.86 | 19.65,44.65 v16.8,41.8 16.8,39.78 | 22.59,41.82 v19.78,41.82 16.82,41.82 | v40.2,36.09 42.09,36.09 v42.6,36.6
  pour Top (isolate 0.61): 85.29,55.92 85.29,55.6 85.25,55.6 85.25,0.12 0.12,0.12 0.12,55.71
  pour Bottom (isolate 0.61): 85,55.71 85,55.7 84.91,55.7 84.91,0.39 0.39,0.39 0.39,0.42 0.34,0.42 0.36,55.69 0.36,55.71
IO-01
  Top 0.254: IC400.144 57.91,11.14 53.89,7.12 JP2.3 | JP2.3
IO-02
  Top 0.254: IC400.143 57.41,11.44 52.58,6.61 52.58,3.04 JP2.4
IO-03
  Top 0.254: IC400.142 56.91,12.06 51.39,6.54 51.39,4.31 JP2.5
IO-04
  Top 0.254: IC400.141 56.41,12.59 50.01,6.19 50.01,3.07 JP2.6
IO-05
  Top 0.254: IC400.136 53.91,11.62 48.76,6.48 48.76,4.32 JP2.7
IO-06
  Top 0.254: IC400.135 53.41,12.05 47.45,6.09 47.45,3.09 JP2.8
IO-07
  Top 0.254: IC400.133 52.41,12.34 46.29,6.22 46.29,4.29 JP2.9
IO-08
  Top 0.254: IC400.132 51.91,12.64 45.01,5.74 45.01,2.99 JP2.10
IO-09
  Top 0.254: IC400.125 48.41,10.84 43.73,6.16 JP2.11 | JP2.11
IO-10
  Top 0.254: IC400.121 46.41,10.05 42.45,6.09 42.45,3.02 JP2.12
IO-11
  Top 0.254: JP2.13 41.19,5.79 45.91,10.5 IC400.120
IO-12
  Top 0.254: IC400.119 45.41,10.97 39.94,5.5 39.94,2.98 JP2.14
IO-13
  Top 0.254: JP2.15 38.65,5.28 43.09,9.72 43.28,9.91 43.41,10.04 IC400.115
IO-14
  Top 0.254: IC400.114 42.91,10.27 38.66,6.03 37.7,6.03 37.41,5.74 37.41,2.97 JP2.16
IO-15
  Top 0.254: JP2.17 36.11,5.99 36.63,6.51 38.48,6.51 42.41,10.44 IC400.113
IO-16
  Top 0.254: IC400.112 41.91,10.6 38.4,7.09 35.75,7.09 34.91,6.25 34.91,2.93 JP2.18
N$1
  Bottom 0.406: R202.1 R203.1 6,25.6 L1.2
N$2
  Top 0.406: F203.3 2.58,36.92 T202.1
N$3
  Top 0.406: T202.4 10.01,31.46 11.12,30.34 14.57,30.34 C205.2
N$4
  Top 0.406: C201.2 9.83,20.98 T201.5
  Bottom 0.406: T201.5 6.74,21 5.06,22.67 5.06,23.43 3.84,24.66 3.84,25.44 L1.1
N$5
  Top 0.406: C202.1 C203.2 11.46,43 11.8,42.66 12.43,42.66 D1.A
N$6
  Top 0.254: IC200.50 23.75,19.73 22.65,18.63 9.98,18.63 T201.4
N$7
  Top 0.254: IC200.46 18.98,26.25 16.32,23.59 9.86,23.59 T201.6
N$8
  Top 0.406: T202.6 11.58,36.54 13,35.12 14.56,33.56 C206.2
N$10
  Top 0.406: R102.1 70.69,20.06 LED3V3B.A
N$11
  Top 0.406: LED2V5.A R103.1
N$13
  Top 0.254: IC200.37 19.46,30.75 18.51,31.7 16.29,31.7 C206.1
N$14
  Bottom 0.406: T202.5 12.09,34 C204.2
N$15
  Top 0.254: IC200.38 16.46,30.25 C205.1
N$16
  Top 0.406: LED801.A R800.1
N$17
  Top 0.406: LED802.A R801.1
N$18
  Top 0.406: LED803.A R802.1
N$19
  Top 0.406: LED804.A R803.1
N$20
  Top 0.406: R101.1 70.59,6.96 LED3V3A.A
N$25
  Top 0.406: F202.3 F203.1
N$28
  Top 0.406: X202.1 7.31,46 8.24,45.07 9.08,45.07 C202.2
N$29
  Top 0.406: C203.1 9.15,42.1 9.94,41.32 9.94,40.01 F202.1
N$30  (via drill 0.6)
  Top 0.254: IC200.33 21.81,32.75 C209.2
  Top 0.406: C210.2 19.44,35.12 19.7,34.86 v19.93,34.63 C209.2
  Bottom 0.254: C207.2 19.03,33.73
  Bottom 0.406: 19.03,33.73 v19.93,34.63
N$32  (via drill 0.6)
  Top 0.254: IC200.32 23.25,34.12 23.16,34.21 22.76,34.21 C209.1 22.03,34.67 | 21.16,35.57 21.1,35.62
  Top 0.406: 21.1,35.62 21.1,36.13 C210.1 | 21.16,35.57 v20.98,35.43 21.74,34.67 22.03,34.67
  Bottom 0.254: C208.2 21.5,36.14
  Bottom 0.406: 21.5,36.14 v20.98,35.43
N$33
  Top 0.254: IC200.42 19.45,28.25 17.76,26.57 16.52,26.57 C211.2
N$34
  Top 0.254: IC200.41 18.88,28.75 18.19,28.07 16.73,28.07 R201.1
N$69
  Top 0.406: X201.1 4.4,12.03 3.78,12.65 3.78,13.51 C200.2
N$71
  Top 0.406: C200.1 9.49,13.53 9.99,14.03 9.99,15.68 F200.1
N$72
  Top 0.406: F200.3 F201.1
N$73
  Top 0.406: T201.3 2.19,17.22 2.6,16.81 2.6,15.78 F201.3
SCL  (via drill 0.6)
  Top 0.406: v33.57,16.4 33.99,16.4 34.49,15.89 34.49,14.8 IC300.8
  Bottom 0.406: JP1.5 14.71,51.34 14.85,51.2 14.85,49.24 R301.1 14.9,48.07 15.98,46.99 15.98,46.2 14.09,43.68 14.14,17.78 15.43,16.29 15.38,14 16.21,13.17 30.34,13.17 v33.57,16.4
SDA  (via drill 0.6)
  Top 0.406: v29.97,10.39 30.1,10.39 30.2,10.59 34.1,10.59 34.36,10.04 34.36,9.01 IC300.7
  Bottom 0.406: JP1.3 11.66,50.66 11.66,49.41 R302.1 11.4,47.16 11.99,46.58 11.99,44.87 13.34,43.53 13.34,16.84 14.55,15.62 14.55,11.03 15.16,10.43 29.94,10.43 v29.97,10.39
SI570_OE
  Top 0.254: IC400.111 41.41,13.33 39.98,11.9 36.55,11.9 IC300.2

### Text on the board
tPlace: RX | RadioBerry | V1.1 | 28-06-2017 | TX | WWW.PA3GSB.NL